# EAGLE board step400_proto_r4 (EAGLE 9.6.2), part 1 of 2
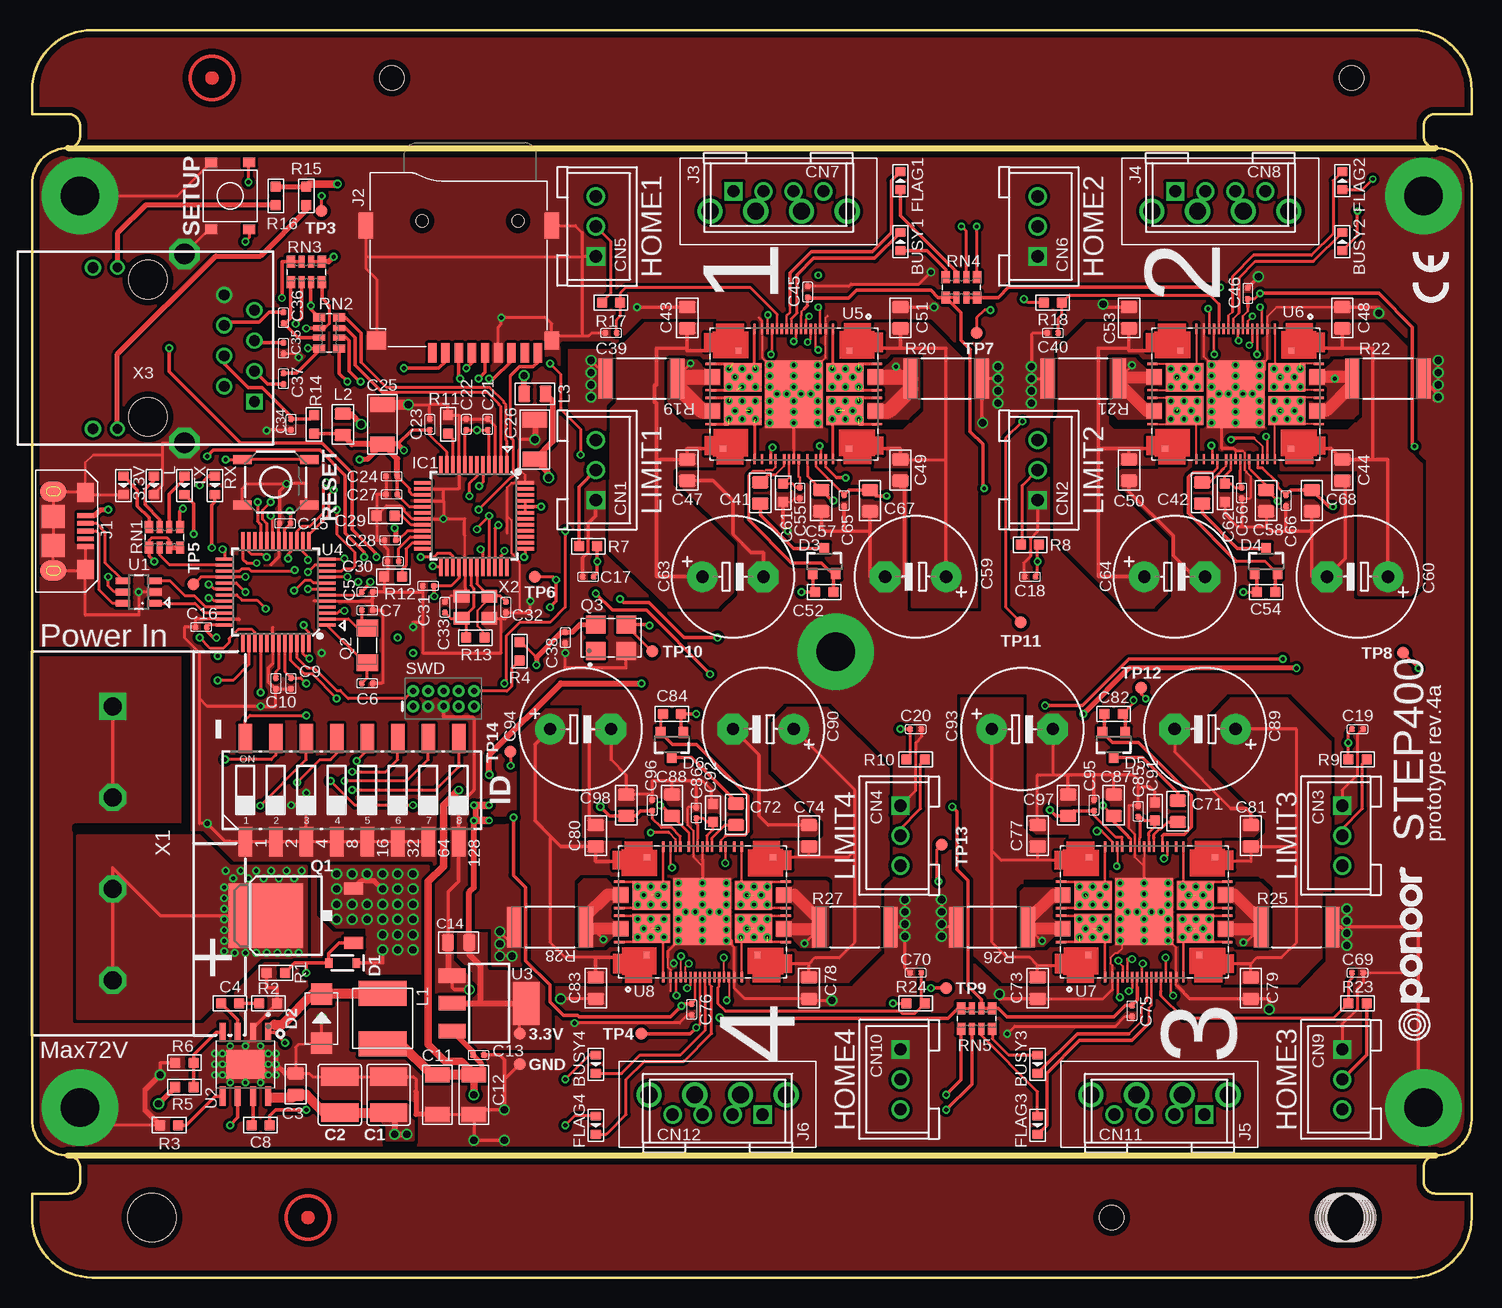
[diagram p3: board, top side]
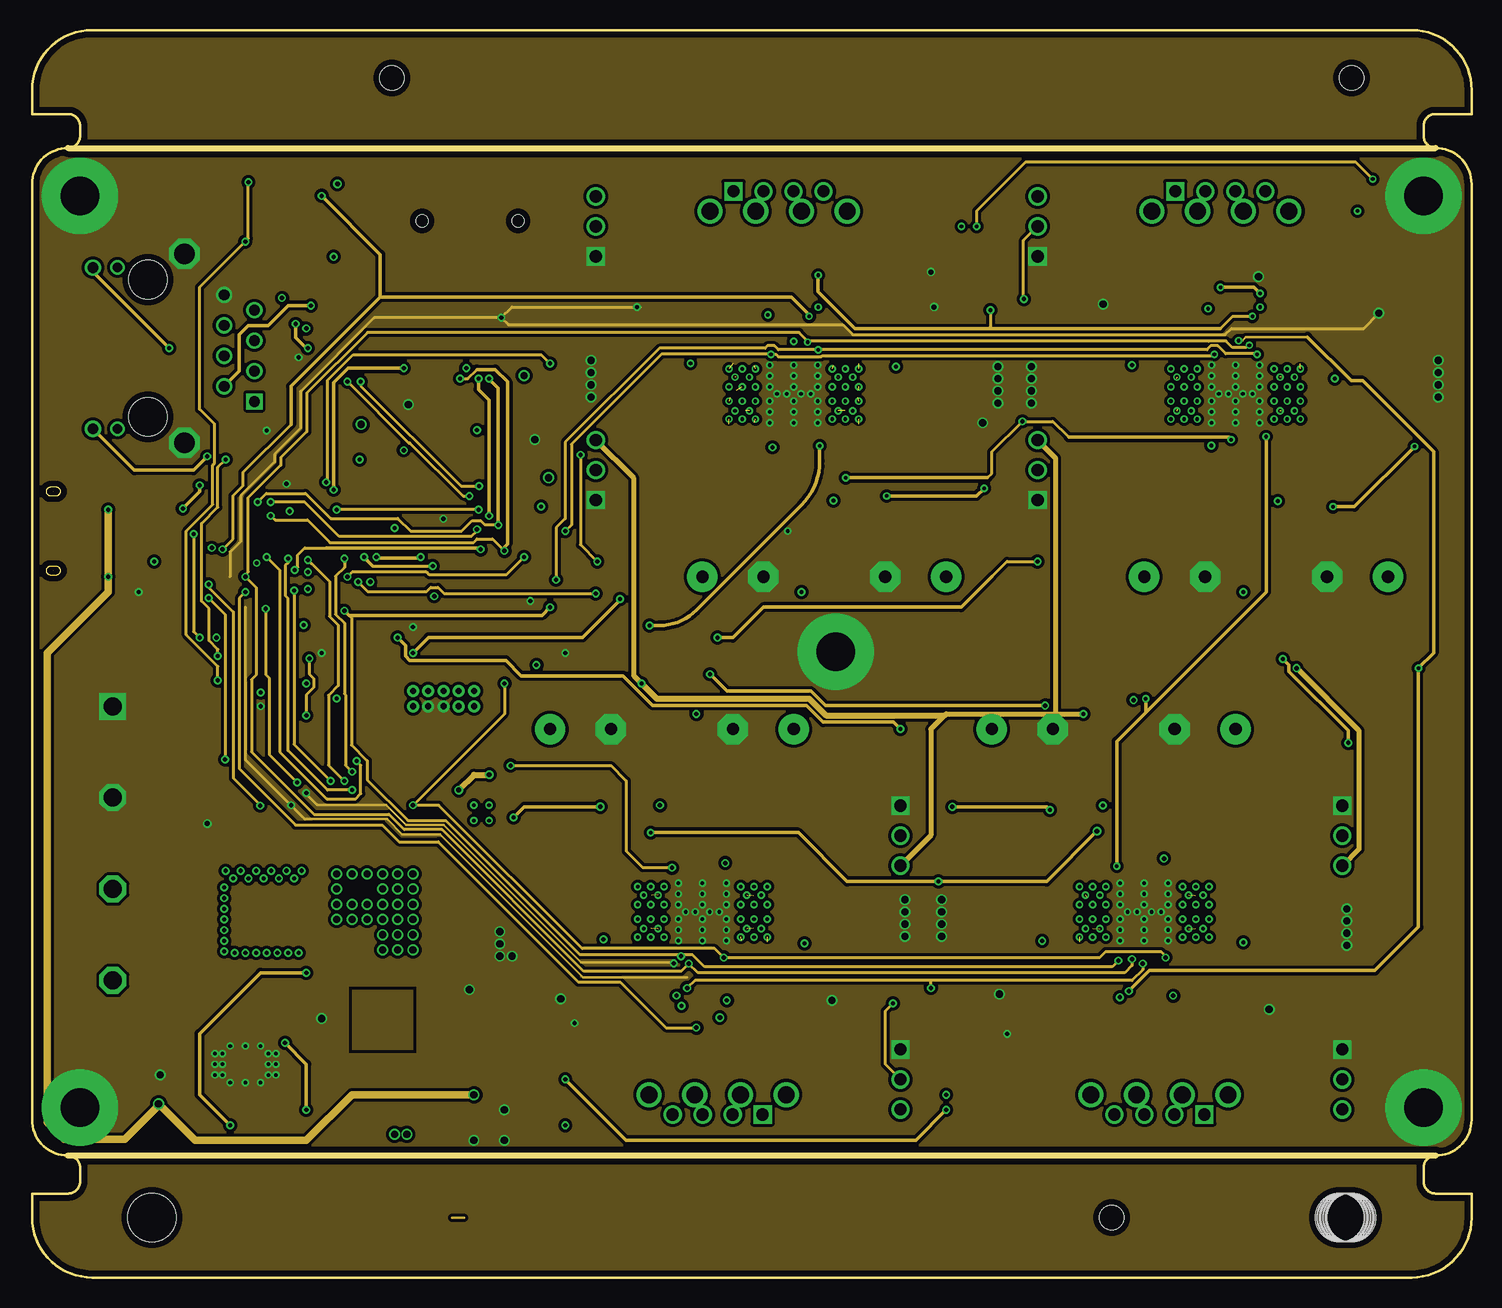
[diagram p4: board, inner layer Route2]
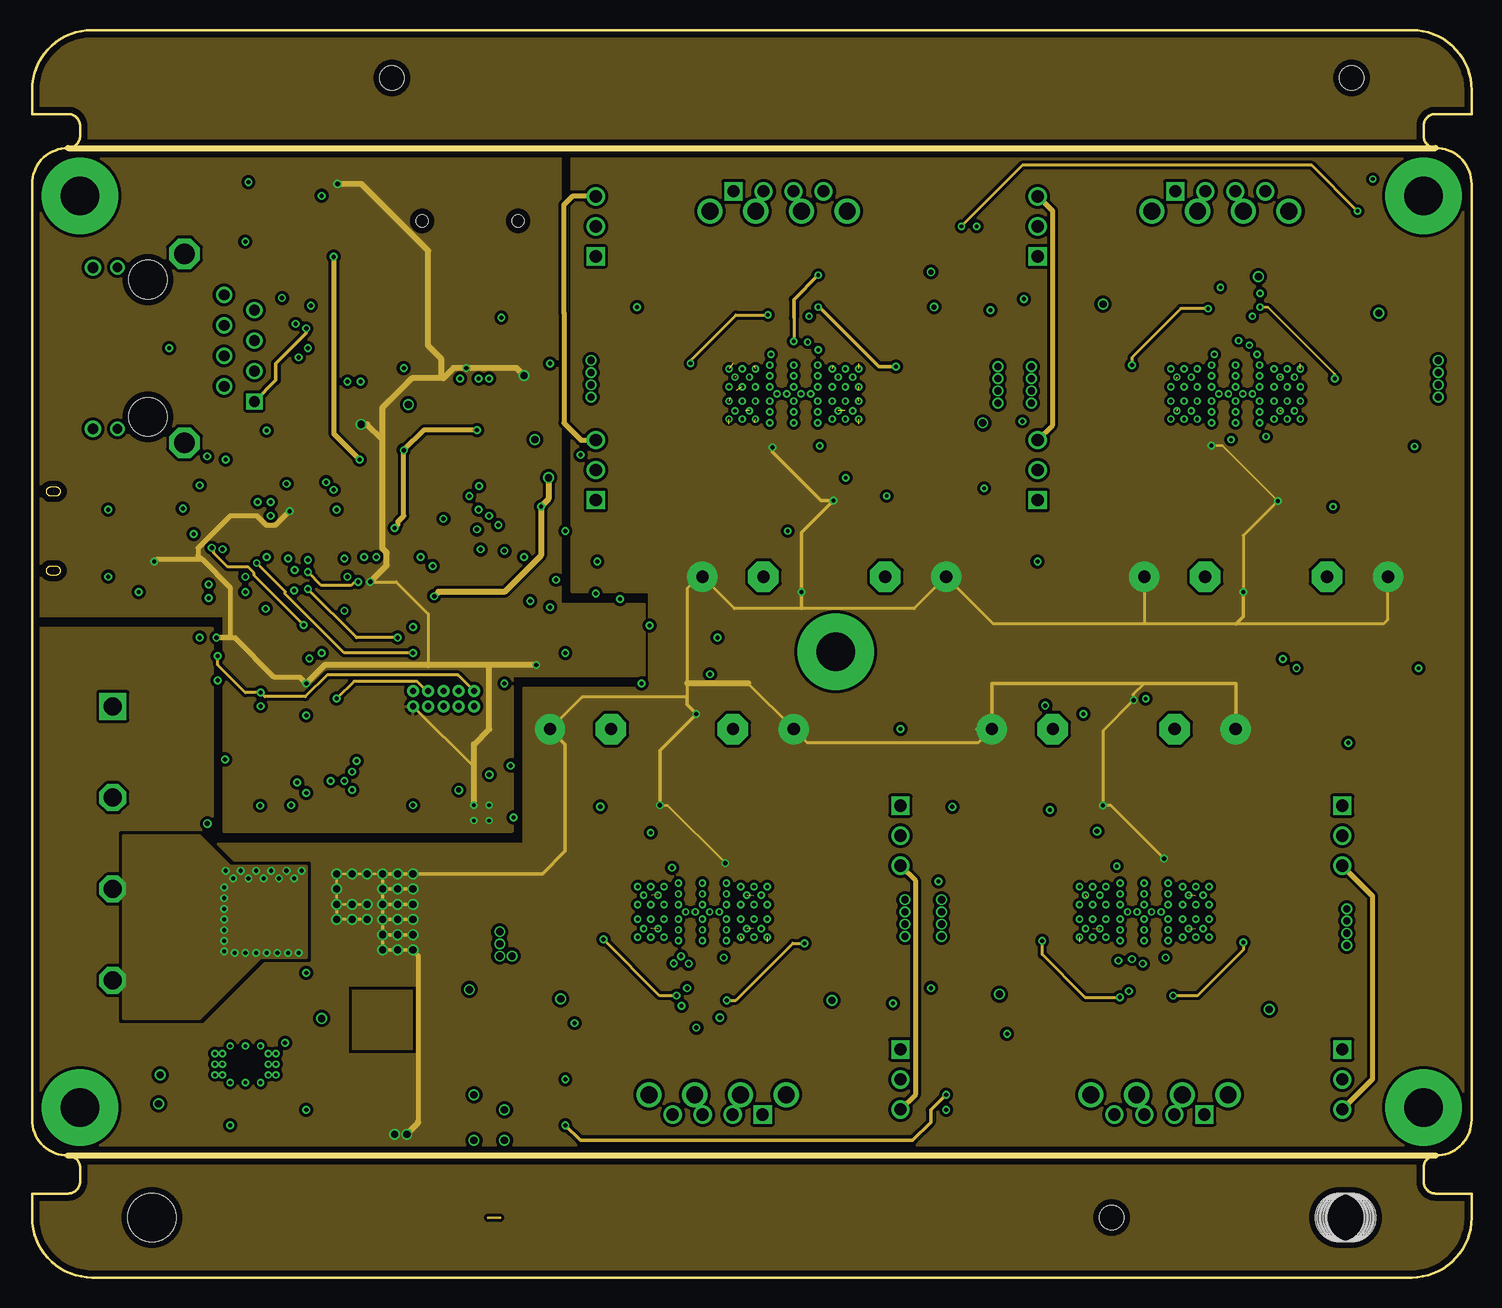
[diagram p5: board, inner layer Route15]
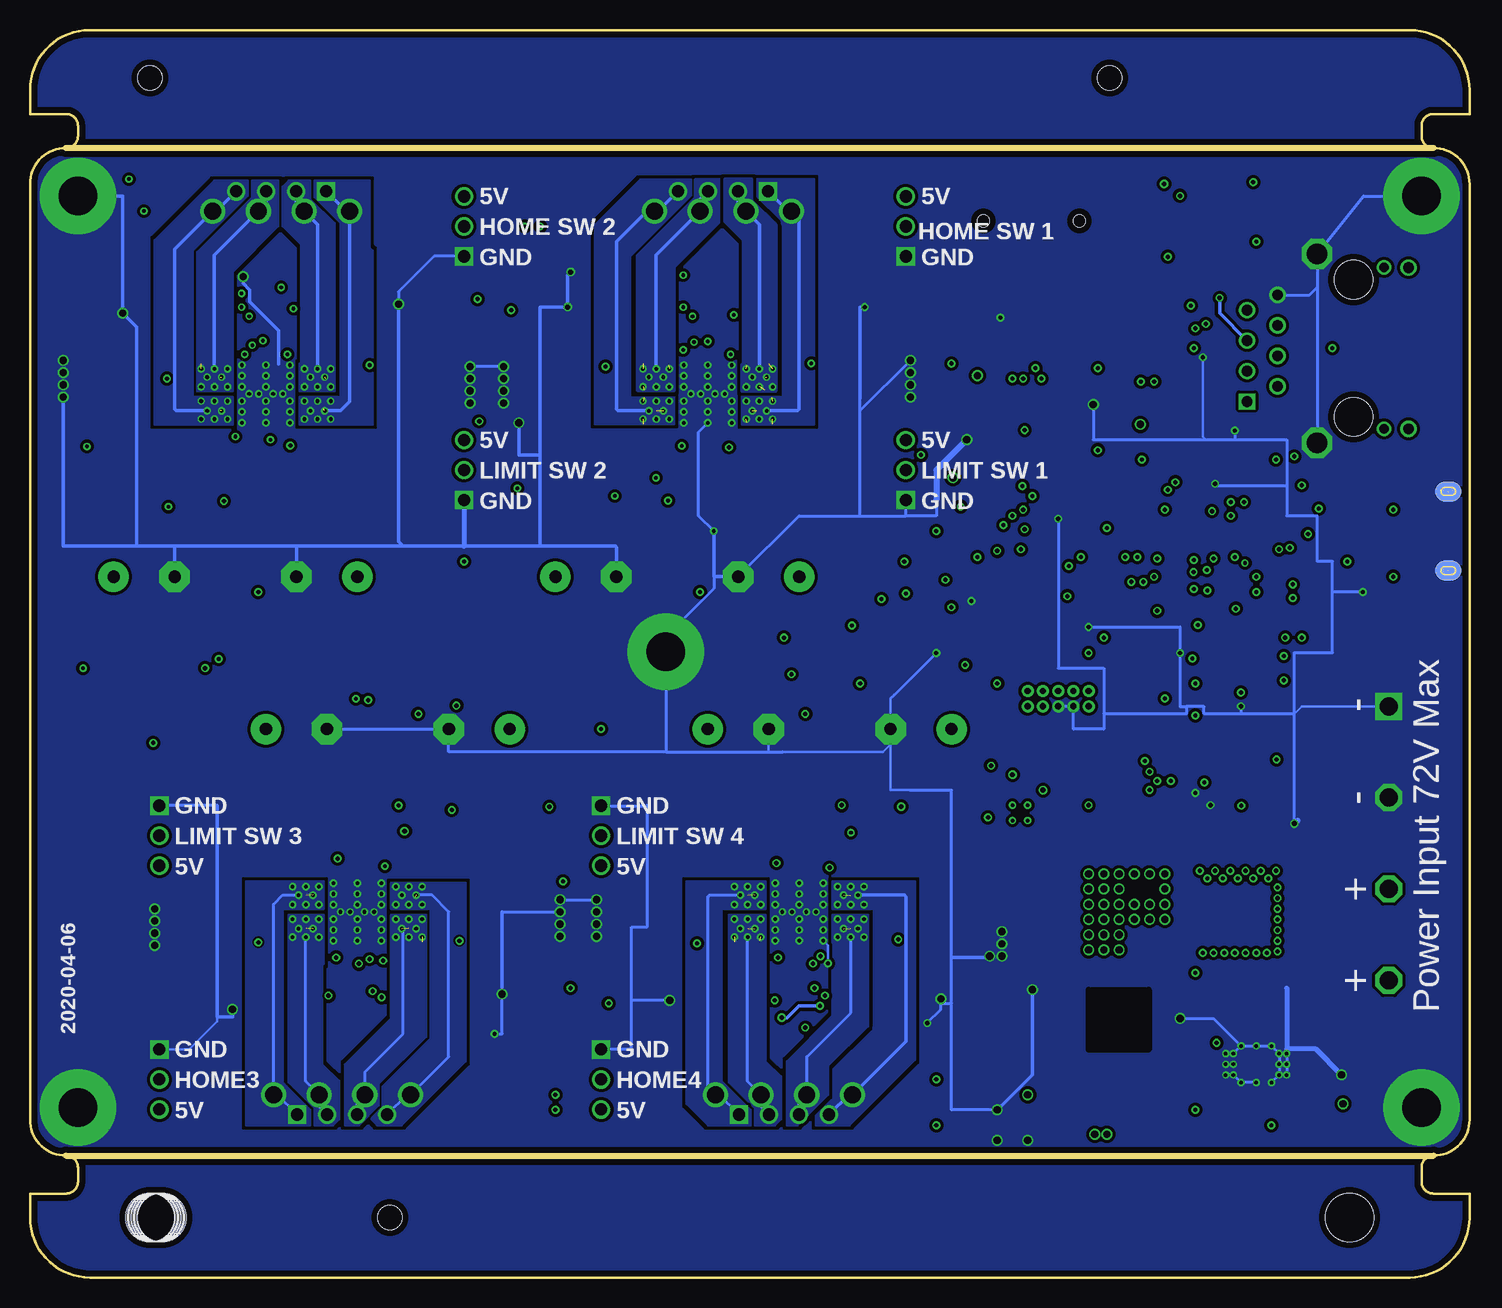
[diagram p6: board, bottom side, seen from below]

Size 120 x 104 mm. Coordinates in mm from the lower left corner, seen from the top.
Outline: 3,94.16 117,94.16
Outline: 117,10.16 3,10.16
Outline: 3,10.16 arc-90 0,13.16 0,91.16 arc-90 3,94.16
Outline: 117,10.16 arc90 120,13.16 120,91.16 arc90 117,94.16
Outline: 117,10.16 arc90 116,9.16 116,8 arc90 117,7 120,7 120,5 arc-90 115,0 5,0 arc-90 0,5 0,7 3,7 arc90 4,8 4,9.16 arc90 3,10.16
Outline: 3,94.16 arc90 4,95.16 4,96 arc90 3,97 0,97 0,99 arc-90 5,104 115,104 arc-90 120,99 120,97 117,97 arc90 116,96 116,95.16 arc90 117,94.16
Copper layers (1+2*15+16): Top 0.035mm / dielectric 1.6mm / Route2 0.035mm / dielectric 1.2mm / Route15 0.035mm / dielectric 0.2mm / Bottom 0.035mm
Design rules "PcbGoGo_4-layer_PCB_eagle_rule *": minimum track width 6mil, minimum drill 12mil, track to track 6mil, track to pad 6mil, pad to pad 6mil, via to via 8mil, smd to smd 0mil, copper to edge 20mil, drill to drill 10mil, minimum pad ring 6mil, minimum via ring 6mil, stop-mask expansion 2mil, vias tented up to drill 100mil, thermal gap 10mil
Holes 2.05 mm at 110,100 90,5 30,100
Holes 4 mm at 10,5 109,5 109.1,5 109.2,5 109.3,5 109.4,5 109.4,5 109.5,5 109.6,5 109.7,5 109.8,5 109.9,5 110,5
tRestrict: area 26.7,19.1 to 31.8,24.1; area 0,52.1 to 13,52.3; area 12.7,37.6 to 13,52.1; area 3.6,37.3 to 13,37.6; area 44.3,72.5 to 44.5,77.7; 2 lines
bRestrict: area 26.7,19 to 31.7,24
vRestrict: area 27.9,19.1 to 33,24.1

## Footprints (pad centres in the part's own frame; a part is rotated, then mirrored left to right if it is on the bottom)
LED-0603 = smd 0.762 x 0.889: + -0.762,0; - 0.762,0
C1210 = smd 1.55 x 3.1: 1 -1.5,0; 2 1.5,0
C0805 = smd 1.397 x 1.016: 1 0,0.889; 2 0,-0.889
C0603 = smd 0.889 x 0.889: 1 0,0.762; 2 0,-0.762
C0402 = smd 0.5 x 0.5: 1 0,0.463; 2 0,-0.463
C1206 = smd 1.27 x 2.032: 1 -1.651,0; 2 1.651,0
E5-10,5 = drill 1.016 pad 2.54: + -2.54,0 | drill 1.016 pad 2.54 octagon: - 2.54,0
B3B-XASK-1 = drill 1.016 square: 1 -2.5,0 | drill 1.016: 2 0,0; 3 2.5,0
B4B-XASK-1 = drill 1.016 square: 1 -3.75,0 | drill 1.016: 2 -1.25,0; 3 1.25,0; 4 3.75,0
SOD-323 = smd 0.63 x 0.83: A 1.15,0; C -1.15,0
DO-214AC = smd 1.8 x 1.77: 1 -2.042,0; 2 2.042,0
SOT23-3 = smd 0.8 x 0.9: 1 -0.95,-1; 2 0.95,-1; 3 0,1.1
TQFP48-LONG = smd 1.5 x 0.28: 1 -4.25,2.75; 2 -4.25,2.25; 3 -4.25,1.75; 4 -4.25,1.25; 5 -4.25,0.75; 6 -4.25,0.25; 7 -4.25,-0.25; 8 -4.25,-0.75; 9 -4.25,-1.25; 10 -4.25,-1.75; 11 -4.25,-2.25; 12 -4.25,-2.75; 25 4.25,-2.75; 26 4.25,-2.25; 27 4.25,-1.75; 28 4.25,-1.25; 29 4.25,-0.75; 30 4.25,-0.25; 31 4.25,0.25; 32 4.25,0.75; 33 4.25,1.25; 34 4.25,1.75; 35 4.25,2.25; 36 4.25,2.75 | smd 0.28 x 1.5: 13 -2.75,-4.25; 14 -2.25,-4.25; 15 -1.75,-4.25; 16 -1.25,-4.25; 17 -0.75,-4.25; 18 -0.25,-4.25; 19 0.25,-4.25; 20 0.75,-4.25; 21 1.25,-4.25; 22 1.75,-4.25; 23 2.25,-4.25; 24 2.75,-4.25; 37 2.75,4.25; 38 2.25,4.25; 39 1.75,4.25; 40 1.25,4.25; 41 0.75,4.25; 42 0.25,4.25; 43 -0.25,4.25; 44 -0.75,4.25; 45 -1.25,4.25; 46 -1.75,4.25; 47 -2.25,4.25; 48 -2.75,4.25
CTS-219-08 = smd 1.13 x 2.44: 1 -8.89,-4.3; 2 -6.35,-4.3; 3 -3.81,-4.3; 4 -1.27,-4.3; 5 1.27,-4.3; 6 3.81,-4.3; 7 6.35,-4.3; 8 8.89,-4.3; 9 8.89,4.3; 10 6.35,4.3; 11 3.81,4.3; 12 1.27,4.3; 13 -1.27,4.3; 14 -3.81,4.3; 15 -6.35,4.3; 16 -8.89,4.3
MICROUSB-FCI-PBAN = smd 0.4 x 1.35: 1 -1.3,1.27; 2 -0.65,1.27; 3 0,1.27; 4 0.65,1.27; 5 1.3,1.27 | smd 1.7 x 2.2: S1 -3.3,-1.4; S2 3.3,-1.4 | smd 1.6 x 1.4: S3 -3.2,1.27; S4 3.2,1.27 | smd 1.9 x 1.9: S5 -1.2,-1.405; S6 1.2,-1.405 | smd 1.7 x 2.2 bottom: S7 -3.3,-1.4; S8 3.3,-1.4
TF-115K = smd 0.7 x 1.6: 1 2.2,0; 2 1.1,0; 3 0,0; 4 -1.1,0; 5 -2.2,0; 6 -3.3,0; 7 -4.4,0; 8 -5.5,0; CD -6.6,0 | smd 1.6 x 1.5: SHIELD1 6.85,-1 | smd 1.2 x 2.2: SHIELD2 7.75,-10.6; SHIELD4 -7.75,-10.6 | smd 1.2 x 1.5: SHIELD3 -7.75,-1 | hole 1: -4.95,-11; 3.05,-11
691321300004 = drill 1.4: 1 -5.715,0; 2 -1.905,0; 3 1.905,0; 4 5.715,0
L5045_L = smd 2.1 x 4: P$1 -2.1,0; P$2 2.1,0
L0805 = smd 1.016 x 1.397: 1 -0.889,0; 2 0.889,0
D-PAK_TO252AA = smd 1 x 1.6: 1 -2.28,-4.8; 3 2.28,-4.8 | smd 5.4 x 6.2: 4 0,2.5
FC-135 = smd 1.4 x 1.8: P$1 -1.45,0; P$2 1.45,0
SG5032 = smd 1.5 x 1.6: 1 -1.1,1.27; 2 -1.1,-1.27; 3 1.1,-1.27; 4 1.1,1.27
R0603 = smd 0.889 x 0.889: 1 0,0.762; 2 0,-0.762
RESC6332X71N = smd 1.194 x 3.353: 1 -2.972,0; 2 2.972,0
TACTILE_SWITCH_SMD_5.2MM = smd 1.524 x 0.762: 1 -2.794,1.905; 2 2.794,1.905; 3 -2.794,-1.905; 4 2.794,-1.905
CAY16_LONG_W = smd 0.7 x 1: 1 -1.3,-0.85; 4 1.3,-0.85; 5 1.3,0.85; 8 -1.3,0.85 | smd 0.5 x 1: 2 -0.4,-0.85; 3 0.4,-0.85; 6 0.4,0.85; 7 -0.4,0.85
STANDOFF-ELECTRICAL = drill 3.2 pad 6.35: P1 0,0
K2-1127SN-A4SW-01 = smd 0.8 x 1: P$1 -2.8,1.6; P$2 2.8,1.6; P$3 -2.8,-1.6; P$4 2.8,-1.6
2X5-PTH-1.27MM = drill 0.508 pad 1: 1 -2.54,-0.635; 2 -2.54,0.635; 3 -1.27,-0.635; 4 -1.27,0.635; 5 0,-0.635; 6 0,0.635; 7 1.27,-0.635; 8 1.27,0.635; 9 2.54,-0.635; 10 2.54,0.635
PAD.03X.04 = smd 1.016 x 1.016: P$1 0,0
SOT23-6L = smd 0.55 x 1.2: 1 -0.95,-1.3; 2 0,-1.3; 3 0.95,-1.3; 4 0.95,1.3; 5 0,1.3; 6 -0.95,1.3
SOIC127P600X100-9N = smd 1.61 x 0.58: 1 -2.655,1.905; 2 -2.655,0.635; 3 -2.655,-0.635; 4 -2.655,-1.905; 5 2.655,-1.905; 6 2.655,-0.635; 7 2.655,0.635; 8 2.655,1.905 | smd 2.4 x 3.2: 9 0,0
SOT223 = smd 1.219 x 2.235: 1 -2.311,-3.099; 2 0,-3.099; 3 2.311,-3.099 | smd 3.6 x 2.2: 4 0,3.099
TQFP-48 = smd 1.5 x 0.28: 1 -4.25,2.75; 2 -4.25,2.25; 3 -4.25,1.75; 4 -4.25,1.25; 5 -4.25,0.75; 6 -4.25,0.25; 7 -4.25,-0.25; 8 -4.25,-0.75; 9 -4.25,-1.25; 10 -4.25,-1.75; 11 -4.25,-2.25; 12 -4.25,-2.75; 25 4.25,-2.75; 26 4.25,-2.25; 27 4.25,-1.75; 28 4.25,-1.25; 29 4.25,-0.75; 30 4.25,-0.25; 31 4.25,0.25; 32 4.25,0.75; 33 4.25,1.25; 34 4.25,1.75; 35 4.25,2.25; 36 4.25,2.75 | smd 0.28 x 1.5: 13 -2.75,-4.25; 14 -2.25,-4.25; 15 -1.75,-4.25; 16 -1.25,-4.25; 17 -0.75,-4.25; 18 -0.25,-4.25; 19 0.25,-4.25; 20 0.75,-4.25; 21 1.25,-4.25; 22 1.75,-4.25; 23 2.25,-4.25; 24 2.75,-4.25; 37 2.75,4.25; 38 2.25,4.25; 39 1.75,4.25; 40 1.25,4.25; 41 0.75,4.25; 42 0.25,4.25; 43 -0.25,4.25; 44 -0.75,4.25; 45 -1.25,4.25; 46 -1.75,4.25; 47 -2.25,4.25; 48 -2.75,4.25
IC_POWERSTEP01_VIA = smd 0.5 x 0.5: 1 -3.6,4.65; 23 -3.6,-4.6; 43 4.55,-5.9; 66 4.55,4.6 | smd 0.86 x 0.19: 7 -5.435,3.27; 8 -5.435,2.65; 9 -5.435,2.2; 10 -5.435,1.8; 11 -5.435,1.4; 12 -5.435,1; 13 -5.435,0.6; 14 -5.435,0.2; 15 -5.435,-0.2; 16 -5.435,-0.6; 17 -5.435,-1; 18 -5.435,-1.4; 19 -5.435,-1.8; 20 -5.435,-2.2; 21 -5.435,-2.65; 22 -5.435,-3.27; 53 5.435,-3.27; 54 5.435,-2.65; 55 5.435,-1.93; 56 5.435,-1.53; 57 5.435,-0.8; 58 5.435,-0.4; 59 5.435,0; 60 5.435,0.4; 61 5.435,1.13; 62 5.435,1.85; 63 5.435,2.25; 64 5.435,2.65; 65 5.435,3.27 | smd 0.19 x 0.86: 33 -2.51,-6.935; 37 -0.32,-6.935; 38 0.32,-6.935; 42 2.51,-6.935; 76 2.51,6.935; 80 0.32,6.935; 81 -0.32,6.935; 85 -2.51,6.935 | smd 1.26 x 1.3: 34 -1.42,-6.79; 39 1.42,-6.79; 77 1.42,6.79; 82 -1.42,6.79 | smd 2.4 x 3.1: EPAD3 -1.38,-4.26; EPAD4 1.38,-4.26; EPAD7 1.38,4.26; EPAD8 -1.38,4.27 | drill 0.3: EPAD3_VIA1 -2.1,-3.2; EPAD3_VIA2 -0.6,-3.2; EPAD3_VIA3 -1.4,-3.7; EPAD3_VIA4 -2.1,-4.3; EPAD3_VIA5 -0.6,-4.3; EPAD3_VIA6 -1.4,-4.9; EPAD3_VIA7 -2.1,-5.4; EPAD3_VIA8 -0.6,-5.4; EPAD4_VIA1 0.6,-3.2; EPAD4_VIA2 2.1,-3.2; EPAD4_VIA3 1.4,-3.7; EPAD4_VIA4 0.6,-4.3; EPAD4_VIA5 2.1,-4.3; EPAD4_VIA6 1.4,-4.9; EPAD4_VIA7 0.6,-5.4; EPAD4_VIA8 2.1,-5.4; EPAD7_VIA1 0.6,5.4; EPAD7_VIA2 2.1,5.4; EPAD7_VIA3 1.4,4.9; EPAD7_VIA4 0.6,4.3; EPAD7_VIA5 2.1,4.3; EPAD7_VIA6 1.4,3.7; EPAD7_VIA7 0.6,3.2; EPAD7_VIA8 2.1,3.2; EPAD8_VIA1 -2.1,5.4; EPAD8_VIA2 -0.6,5.4; EPAD8_VIA3 -1.4,4.9; EPAD8_VIA4 -2.1,4.3; EPAD8_VIA5 -0.6,4.3; EPAD8_VIA6 -1.4,3.7; EPAD8_VIA7 -2.1,3.2; EPAD8_VIA8 -0.6,3.2; EPAD9_VIA1 -2.4,2; EPAD9_VIA2 -1.5,2; EPAD9_VIA3 -0.6,2; EPAD9_VIA4 0.6,2; EPAD9_VIA5 1.5,2; EPAD9_VIA6 2.4,2; EPAD9_VIA7 -2.4,0; EPAD9_VIA8 -1.5,0; EPAD9_VIA9 -0.6,0; EPAD9_VIA10 0.6,0; EPAD9_VIA11 1.5,0; EPAD9_VIA12 2.4,0; EPAD9_VIA13 -2.4,-2; EPAD9_VIA14 -1.5,-2; EPAD9_VIA15 -0.6,-2; EPAD9_VIA16 0.6,-2; EPAD9_VIA17 1.5,-2; EPAD9_VIA18 2.4,-2; EPAD9_VIA19 0,0.6; EPAD9_VIA20 0,1.4; EPAD9_VIA21 0,-0.6; EPAD9_VIA22 0,-1.4 | smd 5.6 x 4.8: EPAD9 0.04,0
WJ25C-B-7.62-4P = drill 1.5 square: P$1 -11.43,0 | drill 1.5 octagon: P$2 -3.81,0; P$3 3.81,0; P$4 11.43,0
CRYSTAL-3.2-2.5 = smd 1.3 x 1.05: 1 -1.15,-0.925; 2 1.15,-0.925; 3 1.15,0.925; 4 -1.15,0.925
HR871181A = drill 0.9 square: 1 -4.44,-8.89 | drill 0.9: 2 -3.175,-6.35; 3 -1.905,-8.89; 4 -0.635,-6.35; 5 0.635,-8.89; 6 1.905,-6.35; 7 3.175,-8.89; 8 4.445,-6.35; 10 -6.725,4.57; 12 6.725,4.57 | drill 0.8: 9 -6.725,2.54; 11 6.725,2.54 | drill 1.7 octagon: SHIELD1 -7.875,-3.05; SHIELD2 7.875,-3.05 | hole 3.2: -5.715,0; 5.715,0

## Placement (x,y rotation side)
3.3V  GREEN-0603  [LED-0603]  7.62,66.04 270 top
BUSY1  GREEN-0603  [LED-0603]  72.39,86.36 90 top
BUSY2  GREEN-0603  [LED-0603]  109.22,86.36 90 top
BUSY3  GREEN-0603  [LED-0603]  83.82,17.78 270 top
BUSY4  GREEN-0603  [LED-0603]  46.99,17.78 270 top
C1  4.7uF/100V  [C1210]  29.72,15.24 90 top
C2  4.7uF/100V  [C1210]  25.65,15.24 90 top
C3  100nF/100V  [C0805]  21.97,16.13 0 top
C4  100nf  [C0603]  16.51,22.86 270 top
C5  100nf  [C0402]  27.94,57.15 90 top
C6  22pF  [C0402]  27.94,49.53 270 top
C7  22pF  [C0402]  27.94,55.63 90 top
C8  100nf  [C0603]  19.05,12.7 90 top
C9  100nf  [C0402]  21.59,49.53 0 top
C10  100nf  [C0402]  20.32,49.53 0 top
C11  47uF  [C1206]  33.78,15.24 90 top
C12  47uF  [C1206]  36.83,15.24 90 top
C13  100nf  [C0402]  37.21,18.54 90 top
C14  10uF/10V  [C0805]  35.56,27.94 90 top
C15  100nf  [C0402]  21.08,62.87 270 top
C16  100nf  [C0402]  14.1,54.23 270 top
C17  100nF  [C0402]  46.35,58.42 90 top
C18  100nF  [C0402]  83.19,58.42 90 top
C19  100nF  [C0402]  110.49,45.72 270 top
C20  100nF  [C0402]  73.66,45.72 270 top
C21  100nf  [C0402]  37.97,71.12 180 top
C22  100nf  [C0402]  36.2,71.12 180 top
C23  100nf  [C0402]  33.15,71.12 180 top
C24  100nf  [C0402]  29.97,66.8 270 top
C25  47uF/6.3V  [C1206]  29.21,71.12 90 top
C26  47uF/6.3V  [C1206]  41.91,69.85 90 top
C27  100nf  [C0402]  29.97,65.28 270 top
C28  100nf  [C0402]  29.84,61.47 270 top
C29  4.7uF/6.3V  [C0603]  29.46,63.5 90 top
C30  10nf  [C0402]  30.1,59.69 90 top
C31  100nf  [C0402]  33.02,57.66 90 top
C32  22pF  [C0402]  39.5,55.88 0 top
C33  22pF  [C0402]  34.42,55.88 180 top
C34  22NF 50V  [C0402]  21.59,71.12 0 top
C35  10nf  [C0402]  20.95,77.47 0 top
C36  6.8nF  [C0402]  20.95,80.01 180 top
C37  6.8nF  [C0402]  20.95,74.93 0 top
C38  100nf  [C0402]  44.45,53.34 180 top
C39  100nF  [C0402]  48.26,78.74 90 top
C40  100nF  [C0402]  85.09,78.74 90 top
C41  47nF  [C0805]  60.71,65.41 0 top
C42  47nF  [C0805]  97.54,65.41 0 top
C43  220nF  [C0805]  54.61,80.01 0 top
C44  220nF  [C0805]  109.22,67.31 180 top
C45  100nf  [C0402]  64.64,82.17 180 top
C46  100nf  [C0402]  101.35,82.04 180 top
C47  220nF  [C0805]  54.61,67.31 180 top
C48  220nF  [C0805]  109.22,80.01 0 top
C49  220nF  [C0805]  72.39,67.31 180 top
C50  220nF  [C0805]  91.44,67.31 180 top
C51  220nF  [C0805]  72.39,80.01 0 top
C52  470nF  [C0603]  66.04,57.15 270 top
C53  220nF  [C0805]  91.44,80.01 0 top
C54  470nF  [C0603]  102.87,57.15 270 top
C55  100nf  [C0402]  64.01,65.41 0 top
C56  100nf  [C0402]  100.84,65.41 0 top
C57  100nF/100V  [C0805]  65.79,64.77 180 top
C58  100nF/100V  [C0805]  102.87,64.77 180 top
C59  100uF  [E5-10,5]  73.66,58.42 180 top
C60  100uF  [E5-10,5]  110.49,58.42 180 top
C61  470nF  [C0603]  62.61,65.41 180 top
C62  470nF  [C0603]  99.44,65.41 180 top
C63  100uF  [E5-10,5]  58.42,58.42 0 top
C64  100uF  [E5-10,5]  95.25,58.42 0 top
C65  220nF  [C0402]  67.69,64.77 180 top
C66  220nF  [C0402]  104.52,64.77 180 top
C67  22uf  [C0805]  69.85,64.77 180 top
C68  22uf  [C0805]  106.68,64.77 180 top
C69  100nF  [C0402]  110.49,25.4 270 top
C70  100nF  [C0402]  73.66,25.4 90 top
C71  47nF  [C0805]  95.5,38.86 180 top
C72  47nF  [C0805]  58.67,38.61 180 top
C73  220nF  [C0805]  83.82,24.13 180 top
C74  220nF  [C0805]  64.77,36.83 0 top
C75  100nf  [C0402]  91.69,22.23 0 top
C76  100nf  [C0402]  54.99,22.35 0 top
C77  220nF  [C0805]  83.82,36.83 0 top
C78  220nF  [C0805]  64.77,24.13 180 top
C79  220nF  [C0805]  101.6,24.13 180 top
C80  220nF  [C0805]  46.99,36.83 0 top
C81  220nF  [C0805]  101.6,36.83 0 top
C82  470nF  [C0603]  90.17,46.99 90 top
C83  220nF  [C0805]  46.99,24.13 180 top
C84  470nF  [C0603]  53.34,46.99 90 top
C85  100nf  [C0402]  92.2,38.86 180 top
C86  100nf  [C0402]  55.37,38.73 180 top
C87  100nF/100V  [C0805]  90.17,39.37 0 top
C88  100nF/100V  [C0805]  53.34,39.37 0 top
C89  100uF  [E5-10,5]  97.79,45.72 180 top
C90  100uF  [E5-10,5]  60.96,45.72 180 top
C91  470nF  [C0603]  93.6,38.86 0 top
C92  470nF  [C0603]  56.77,38.73 0 top
C93  100uF  [E5-10,5]  82.55,45.72 0 top
C94  100uF  [E5-10,5]  45.72,45.72 0 top
C95  220nF  [C0402]  88.52,39.37 0 top
C96  220nF  [C0402]  51.69,39.37 0 top
C97  22uf  [C0805]  86.36,39.37 0 top
C98  22uf  [C0805]  49.53,39.37 0 top
CN1  [B3B-XASK-1]  46.99,67.31 90 top
CN2  [B3B-XASK-1]  83.82,67.31 90 top
CN3  [B3B-XASK-1]  109.22,36.83 270 top
CN4  [B3B-XASK-1]  72.39,36.83 270 top
CN5  [B3B-XASK-1]  46.99,87.63 90 top
CN6  [B3B-XASK-1]  83.82,87.63 90 top
CN7  [B4B-XASK-1]  62.23,90.55 0 top
CN8  [B4B-XASK-1]  99.06,90.55 0 top
CN9  [B3B-XASK-1]  109.22,16.51 270 top
CN10  [B3B-XASK-1]  72.39,16.51 270 top
CN11  [B4B-XASK-1]  93.98,13.59 180 top
CN12  [B4B-XASK-1]  57.15,13.59 180 top
D1  5.1V  [SOD-323]  25.88,26.21 180 top
D2  100V 2A  [DO-214AC]  24.13,21.59 90 top
D3  BAR43  [SOT23-3]  66.04,59.69 0 top
D4  BAR43  [SOT23-3]  102.87,59.69 0 top
D5  BAR43  [SOT23-3]  90.17,44.45 180 top
D6  BAR43  [SOT23-3]  53.34,44.45 180 top
FLAG1  YELLOW-0603  [LED-0603]  72.39,91.44 90 top
FLAG2  YELLOW-0603  [LED-0603]  109.22,91.44 90 top
FLAG3  YELLOW-0603  [LED-0603]  83.82,12.7 270 top
FLAG4  YELLOW-0603  [LED-0603]  46.99,12.7 270 top
IC1  0982_W5500LONG  [TQFP48-LONG]  36.83,63.5 270 top
ID  219-08  [CTS-219-08]  26.67,40.64 0 top
J1  [MICROUSB-FCI-PBAN]  3.17,62.23 270 top
J2  SDCARD_SLOT_TF-115K  [TF-115K]  35.56,77.09 180 top
J3  691321300004  [691321300004]  62.23,88.9 0 top
J4  691321300004  [691321300004]  99.06,88.9 0 top
J5  691321300004  [691321300004]  93.98,15.24 180 top
J6  691321300004  [691321300004]  57.15,15.24 180 top
L  BLUE-0603  [LED-0603]  10.16,66.04 270 top
L1  150uH  [L5045_L]  29.21,21.59 270 top
L2  330R-1500MA  [L0805]  25.91,71.12 270 top
L3  330R-1500MA  [L0805]  41.91,73.66 0 top
Q1  SUD50P08-25L-E3  [D-PAK_TO252AA]  22,30.16 90 top
Q2  32.768kHz  [FC-135]  27.94,52.7 270 top
Q3  16MHz  [SG5032]  48.26,53.34 90 top
R1  100k  [R0603]  20.32,25.4 90 top
R2  4.7k  [R0603]  19.68,22.86 270 top
R3  13k  [R0603]  11.43,12.7 90 top
R4  10K 1/10W  [R0603]  40.64,52.2 180 top
R5  3k  [R0603]  12.7,15.88 270 top
R6  750  [R0603]  12.7,17.91 90 top
R7  100R  [R0603]  46.35,60.96 90 top
R8  100R  [R0603]  83.19,61.09 90 top
R9  100R  [R0603]  110.49,43.18 270 top
R10  100R  [R0603]  73.66,43.18 270 top
R11  12.4K  [R0603]  34.67,71.12 0 top
R12  10K 1/10W  [R0603]  30.1,58.42 90 top
R13  1M 1/10W  [R0603]  36.96,53.34 270 top
R14  10R  [R0603]  23.5,71.12 0 top
R15  330R  [R0603]  22.86,90.17 180 top
R16  330R  [R0603]  20.32,90.17 180 top
R17  100R  [R0603]  48.26,81.28 90 top
R18  100R  [R0603]  85.09,81.28 90 top
R19  0.1  [RESC6332X71N]  50.8,74.93 180 top
R20  0.1  [RESC6332X71N]  76.2,74.93 0 top
R21  0.1  [RESC6332X71N]  87.63,74.93 180 top
R22  0.1  [RESC6332X71N]  113.03,74.93 0 top
R23  100R  [R0603]  110.49,22.86 270 top
R24  100R  [R0603]  73.66,22.86 90 top
R25  0.1  [RESC6332X71N]  105.41,29.21 0 top
R26  0.1  [RESC6332X71N]  80.01,29.21 180 top
R27  0.1  [RESC6332X71N]  68.58,29.21 0 top
R28  0.1  [RESC6332X71N]  43.18,29.21 180 top
RESET  [TACTILE_SWITCH_SMD_5.2MM]  20.32,66.29 0 top
RN1  330  [CAY16_LONG_W]  11.05,61.72 180 top
RN2  33  [CAY16_LONG_W]  24.77,78.74 270 top
RN3  49.9  [CAY16_LONG_W]  22.86,83.82 180 top
RN4  330  [CAY16_LONG_W]  77.47,82.55 0 top
RN5  330  [CAY16_LONG_W]  78.74,21.59 180 top
RX  RED-0603  [LED-0603]  15.24,66.04 270 top
S2  STANDOFF_ELECTRICAL  [STANDOFF-ELECTRICAL]  67,52.16 0 top
S3  STANDOFF_ELECTRICAL  [STANDOFF-ELECTRICAL]  116,90.16 0 top
S4  STANDOFF_ELECTRICAL  [STANDOFF-ELECTRICAL]  116,14.16 0 top
S5  STANDOFF_ELECTRICAL  [STANDOFF-ELECTRICAL]  4,90.16 0 top
S6  STANDOFF_ELECTRICAL  [STANDOFF-ELECTRICAL]  4,14.16 0 top
SETUP  SWITCH-SPST_K2-1127SN-A4SW-01  [K2-1127SN-A4SW-01]  16.51,90.17 270 top
SWD  CORTEX_DEBUGPTH  [2X5-PTH-1.27MM]  34.29,48.26 0 top
TP1  TEST-POINT3X4  [PAD.03X.04]  40.64,20.32 0 top
TP2  TEST-POINT3X4  [PAD.03X.04]  40.64,17.78 0 top
TP3  TEST-POINT3X4  [PAD.03X.04]  24.13,88.9 0 top
TP4  TEST-POINT3X4  [PAD.03X.04]  50.8,20.32 0 top
TP5  TEST-POINT3X4  [PAD.03X.04]  13.46,57.78 0 top
TP6  TEST-POINT3X4  [PAD.03X.04]  41.91,58.42 0 top
TP7  TEST-POINT3X4  [PAD.03X.04]  78.74,78.74 0 top
TP8  TEST-POINT3X4  [PAD.03X.04]  114.3,52.07 0 top
TP9  TEST-POINT3X4  [PAD.03X.04]  76.2,24.13 0 top
TP10  TEST-POINT3X4  [PAD.03X.04]  51.69,52.2 0 top
TP11  TEST-POINT3X4  [PAD.03X.04]  82.42,54.61 0 top
TP12  TEST-POINT3X4  [PAD.03X.04]  92.46,49.15 0 top
TP13  TEST-POINT3X4  [PAD.03X.04]  75.82,36.07 0 top
TP14  TEST-POINT3X4  [PAD.03X.04]  39.88,43.81 0 top
TX  YELLOW-0603  [LED-0603]  12.7,66.04 270 top
U1  USBLC6-2SC6  [SOT23-6L]  8.89,57.15 90 top
U2  BD9G341AEFJ  [SOIC127P600X100-9N]  17.78,17.78 270 top
U3  LD1117S33  [SOT223]  38.1,22.86 270 top
U4  ATSAMD21G-A  [TQFP-48]  20.32,57.15 180 top
U5  POWERSTEP01_VIA  [IC_POWERSTEP01_VIA]  63.5,73.66 270 top
U6  POWERSTEP01_VIA  [IC_POWERSTEP01_VIA]  100.33,73.66 270 top
U7  POWERSTEP01_VIA  [IC_POWERSTEP01_VIA]  92.71,30.48 90 top
U8  POWERSTEP01_VIA  [IC_POWERSTEP01_VIA]  55.88,30.48 90 top
U$1  [PONOOR_TEXT_15MM]  116.84,19.05 90 top
U$2  [FIDUCIAL_MARKER_PBAN]  23,5 0 top
U$3  [FIDUCIAL_MARKER_PBAN]  15,100 0 top
U$4  [CE_3MM]  118.11,81.28 90 top
X1  CONN_04WJ25C-B-7.62  [WJ25C-B-7.62-4P]  6.73,36.2 270 top
X2  25MHz  [CRYSTAL-3.2-2.5]  36.96,55.88 0 top
X3  RJ45_MAGNETICS_LED_HR871181A  [HR871181A]  9.65,77.47 90 top

## Tracks (layer width: path | path; a pad name or v marks a point on that pad's centre or on a via)
1V2O
  Top 0.254: C30.2 30.56,60.79 31.52,61.75 IC1.22
3.3V  (via drill 0.3 pad 0.3, 0.35, 0.4 pad 0.3, 0.6)
  Top 0.254: U4.44 21.07,50.51 C9.1 22.4,49.99 v22.86,49.53 | U4.36 14.73,54.4 C16.1 | U4.6 27.23,56.9 C5.1 | RN1.7 11.45,61.45 11.25,61.65 9.96,61.65 9.75,61.44 RN1.5 | U4.17 21.07,62.39 C15.1 | R4.2 40.77,52.96 42.04,51.69 | TP1.P$1 40.64,21.59 41.91,22.86
  Top 0.305: C16.1 14.56,53.89 15.11,53.34 v15.37,53.34 | v28.19,57.99 28.19,57.87 28.11,57.78 28.07,57.78 27.77,57.48 27.77,57.44 C5.1 | v10.19,59.69 9.75,60.13 RN1.5 | v21.46,63.88 21.54,63.8 C15.1 | J2.4 36.66,76.28 v36.2,75.82
  Top 0.406: RN1.7 RN1.8 | R16.2 R15.2 | Q3.4 45.68,54.44 45.04,53.8 C38.2 44.15,53.8 42.04,51.69 v42.04,51.05
  Top 0.508: v36.83,39.37 36.96,39.24 36.96,38.23 v36.83,38.1 36.83,32.51 36.45,32.13 C14.2 36.45,26.92 37.34,26.04 37.34,22.86 | L3.1 v41.02,75.18 | v27.43,71.12 26.54,72.01 L2.1 | U3.2 37.34,22.86 | 37.34,22.86 U3.4 41.91,22.86
  Top 0.61: v38.1,38.1 v36.83,38.1 | v38.1,39.37 v36.83,39.37 | R15.2 23.09,91.16 v25.46,91.16
  Route15 0.254: SWD.1 36.83,42.55 v36.83,39.37 | v28.19,57.99 30.35,57.99 33.02,55.33 33.02,51.05
  Route15 0.406: v22.86,49.53 22.35,50.04 20.19,50.04 16.89,53.34 v15.37,53.34 16.51,53.34 16.51,57.53 14.16,59.88 | v21.46,63.88 20.27,62.69 19.55,62.69 18.75,63.5 16.51,63.5 13.84,60.83 13.84,60.2 14.16,59.88 | v10.19,59.69 10.38,59.88 14.16,59.88
  Route15 0.508: v42.04,51.05 38.1,51.05 | 38.1,51.05 33.02,51.05 24.38,51.05 v22.86,49.53 | 34.29,74.97 34.13,75.13 34.13,76.56 33.02,77.67 33.02,85.6 27.46,91.16 v25.46,91.16 | 34.29,74.97 35.13,75.82 v36.2,75.82 40.39,75.82 v41.02,75.18 | v36.83,39.37 36.83,44.45 38.1,45.72 38.1,51.05 | 29.21,69.85 29.21,60.78 29.56,60.43 29.56,59.36 v28.19,57.99 | 29.21,69.85 29.21,72.52 31.67,74.97 34.29,74.97 | 29.21,69.85 27.94,71.12 v27.43,71.12
  pour Route15 (isolate 0.254, rank 6): 0,94.16 44,94.16 44,56.16 51,56.16 51,50.16 40,50.16 40,37.16 16,37.16 16,55.16 0,55.16
  pour Top (isolate 0.254, rank 4, no thermals): 35.56,28.7 38.35,28.7 38.23,28.57 38.23,25.78 38.48,26.04 42.93,26.04 43.18,25.78 43.18,19.05 36.83,19.05 36.83,25.4 35.56,26.67
5V  (via drill 0.35, 0.4, 0.6)
  Top 0.254: v6.35,58.42 6.35,57.66 6.86,57.15 U1.5
  Top 0.406: R5.2 v10.54,14.48 | J1.1 5.24,63.53 5.71,64.01 v6.35,64.01 | v105.41,50.8 91.44,50.8 v87.63,46.99 | U3.3 36.75,18.8 C13.1 37.07,18.22 37.47,17.82 37.47,17.27 37.08,16.89 C12.2
  Top 0.508: v38.1,41.91 38.1,43.55 44.08,49.53 v50.8,49.53
  Top 0.61: v36.83,15.24 C12.2 36.83,17.02 35.81,18.03 34.42,18.03 33.02,19.43 33.02,33.02 34.29,34.29 34.29,39.37 v35.56,40.64
  Top 0.813: C12.2 C11.2 33.33,16.89 30.73,19.49 L1.P$2
  Route2 0.406: 85.34,46.99 76.2,46.99 76.07,46.86 74.93,45.72 74.93,36.87 CN4.3 | 85.34,46.99 v87.63,46.99 | v105.41,50.8 110.62,45.59 110.62,35.73 CN3.3 | 85.34,46.99 85.34,68.29 CN2.3 | v50.8,49.53 50.16,50.16 50.16,66.64 CN1.3
  Route2 0.508: v38.1,41.91 36.83,41.91 v35.56,40.64 | v50.8,49.53 52.07,48.26 64.77,48.26 66.17,46.86 76.07,46.86
  Route2 0.61: v6.35,64.01 v6.35,58.42 6.35,57.15 1.27,52.07 1.27,12.95 2.7,11.53 7.72,11.53 10.54,14.35 v10.54,14.48 13.59,11.43 22.86,11.43 26.67,15.24 v36.83,15.24
  Route15 0.406: CN5.3 45.05,90.13 44.32,89.41 44.32,80.44 44.34,80.42 44.34,71.23 45.76,69.81 CN1.3 | CN9.3 111.76,16.55 111.76,31.79 CN3.3 | CN2.3 85.09,71.08 85.09,88.9 83.82,90.17 CN6.3 | CN10.3 73.66,15.28 73.66,33.06 CN4.3
!RESET  (via drill 0.35)
  Top 0.254: U4.40 19.07,52 19.05,51.99 v19.05,48.77 | R4.1 39.98,50.77 39.98,49.28 39.59,48.9 SWD.10 | RESET.2 RESET.1 v16.13,68.2
  Route2 0.254: v16.13,68.2 15.48,67.55 15.48,64.21 14.12,62.86 14.12,56.4 14.76,55.76 14.76,53.09 15.48,52.37 v15.48,51.82
  Route15 0.254: SWD.10 35.51,50.21 24.58,50.21 22.78,48.42 19.4,48.42 v19.05,48.77 v19.04,48.76 17.78,48.76 15.48,51.06 v15.48,51.82
+3V3A  (via drill 0.35)
  Top 0.254: IC1.4 38.08,70.55 C21.1 v37.08,70.66 C22.1 36.08,70.54 IC1.8 | IC1.11 34.58,68.8 33.15,70.23 C23.1 | IC1.21 31.3,62.25 30.52,61.47 C28.1 | IC1.17 31.46,64.25 C27.1 | C24.1 31.47,65.76 31.47,65.46 31.69,65.25 IC1.15
  Top 0.305: RN3.1 RN3.2 | C24.1 C27.1 | 30.48,69.47 31.67,70.66 C23.1 | R14.2 25.78,70.36 L2.2
  Top 0.406: v30.99,68.96 30.48,69.47 C25.1 27.94,68.2 v27.3,68.2 | v25.15,85.09 24.73,84.67 RN3.1 | v30.23,62.48 30.31,62.4 C28.1
  Top 0.508: L2.2 26.67,69.47 C25.1 30.43,68.25 C24.1
  Route15 0.406: v37.08,70.66 32.68,70.66 v30.99,68.96 30.99,63.5 30.48,62.99 30.48,62.74 v30.23,62.48 | v27.3,68.2 25.15,70.36 v25.15,85.09
+3V3D  (via drill 0.35, 0.6)
  Top 0.254: IC1.28 35.58,58.31 34.92,57.66 C31.2 | IC1.45 IC1.44 IC1.43
  Top 0.305: v33.53,56.8 33.53,57.61 C31.2 | IC1.44 41.09,64.26 v42.42,64.26
  Top 0.508: L3.2 43.41,73.05 43.41,69.7 C26.1 43.05,67.06 v43.05,66.67
  Route15 0.508: v43.05,66.67 43.05,64.9 v42.42,64.26 42.42,60.2 39.37,57.15 33.88,57.15 v33.53,56.8
ACT  (via drill 0.35)
  Top 0.254: IC1.27 35.08,60.14 34.87,60.36 33.79,60.36 33.49,60.06 v32.38,60.06
  Top 0.305: v28.7,60.07 28.7,60.33 26.67,62.36 26.67,67.06 24.18,69.55 17.4,69.55 11.43,75.51 v11.43,77.47
  Route2 0.305: v32.38,60.06 32.32,59.99 28.78,59.99 v28.7,60.07 | v11.43,77.47 5.08,83.82 X3.12
D13
  Top 0.254: U4.26 11.47,59.4 10.65,60.22 RN1.6
D+
  Top 0.254: J1.3 5.33,62.23 5.56,62.01 5.56,57.34 6.7,56.2 U1.6
DIPSW1  (via drill 0.35)
  Top 0.254: v23.11,51.6 22.92,51.79 22.78,51.79 22.57,52.01 U4.47 | v22.86,46.86 18.16,46.86 17.78,46.48 ID.16
  Route2 0.254: v23.11,51.6 23.11,50.31 23.49,49.93 23.49,49.19 22.86,48.56 v22.86,46.86
DIPSW2  (via drill 0.35)
  Top 0.254: U4.32 15.17,56.4 14.94,56.64 v14.73,56.64 | ID.15 20.32,43.56 19.94,43.18 v16.08,43.18
  Route2 0.254: v14.73,56.64 16.08,55.29 v16.08,43.18
DIPSW3  (via drill 0.35)
  Top 0.254: U4.30 15.17,57.4 14.79,57.78 v14.73,57.78 | ID.14 22.86,43.18 v19.01,39.33
  Route2 0.254: v14.73,57.78 14.73,57.53 16.76,55.49 16.76,41.62 19.01,39.38 v19.01,39.33
DIPSW4  (via drill 0.35)
  Top 0.254: U4.31 17.07,56.9 17.5,56.47 18.76,56.47 v19.48,55.75 | v22.1,41.27 24,43.18 24.89,43.18 25.4,43.69 ID.13
  Route2 0.254: v22.1,41.27 19.78,43.59 19.78,49.96 19.48,50.26 v19.48,55.75
DIPSW5  (via drill 0.35)
  Top 0.254: v19.56,60.07 19.4,60.07 19.18,60.29 18.28,60.29 18.07,60.5 U4.23 | v27.05,43.05 27.94,43.94 ID.12
  Route2 0.254: v19.56,60.07 20.65,58.98 20.65,43.82 24.56,39.91 26.97,39.91 27.4,40.34 27.4,42.7 v27.05,43.05
DIPSW6  (via drill 0.35)
  Top 0.254: U4.12 25.99,59.9 v26.04,59.94 | ID.11 30.48,43.18 29.46,42.16 v26.67,42.16
  Route2 0.254: v26.04,59.94 26.04,59.2 25.3,58.47 25.3,55.28 26.04,54.55 26.04,48.66 26.13,48.56 26.13,42.7 v26.67,42.16
DIPSW7  (via drill 0.35)
  Top 0.254: U4.14 22.57,60.5 22.99,60.09 v22.99,59.82 | ID.10 33.02,43.18 31.24,41.4 v26.04,41.4
  Route2 0.254: v22.99,59.82 23.27,59.53 23.3,59.53 24.8,58.04 24.8,55.12 25.53,54.39 25.53,49.35 24.71,48.53 24.71,42.71 26.02,41.4 v26.04,41.4
DIPSW8  (via drill 0.35)
  Top 0.254: U4.16 21.57,60.5 21.34,60.27 v21.34,59.94 | v26.67,40.64 33.66,40.64 35.56,42.55 ID.9
  Route2 0.254: v21.34,59.94 21.34,59.58 21.16,59.4 21.16,56.8 21.34,56.62 21.34,43.92 24.62,40.64 v26.67,40.64
G1
  pour Top (isolate 0.254): 0,5 arc90 5,0 115,0 arc90 120,5 120,7 116,7 116,10 4,10 4,7 0,7
G2
  pour Route2 (isolate 0.254): 4,10.16 4,7 0,7 0,5 arc90 5,0 115,0 arc90 120,5 120,7 116,7 116,10.16
G3
  pour Route15 (isolate 0.254): 4,10.16 4,7 0,7 0,5 arc90 5,0 115,0 arc90 120,5 120,7 116,7 116,10.16
G4
  pour Bottom: 4,10 4,7 0,7 0,5 arc90 5,0 115,0 arc90 120,5 120,7 117,7 arc-90 116,8 116,10
G5
  pour Top (isolate 0.254): 5,104 arc90 0,99 0,97 4,97 4,94 116,94 116,97 120,97 120,99 arc90 115,104
G6
  pour Route2 (isolate 0.254): 5,104 arc90 0,99 0,97 4,97 4,94 116,94 116,97 120,97 120,99 arc90 115,104
G7
  pour Route15 (isolate 0.254): 4,94 4,97 0,97 0,99 arc-90 5,104 115,104 arc-90 120,99 120,97 116,97 116,94
G8
  pour Bottom (isolate 0.254): 0,99 arc-90 5,104 115,104 arc-90 120,99 120,97 116,97 116,94 4,94 4,97 0,97
GND  (via drill 0.3, 0.3 pad 0.3, 0.35, 0.4 pad 0.3, 0.6)  (2 unrouted)
  Top 0.152: 65.52,76.06 65.52,75.16 | U5.21 60.85,76.69 62.38,75.16 62.52,75.16 | 102.27,75.16 102.75,75.64 102.75,76.37 102.98,76.6 | 102.98,80.12 103,80.14 | 98.27,76.2 98.27,75.16 | U7.59 92.71,34.97 92.7,34.96 | 90.06,26.02 89.92,26.16 89.92,26.68 90.29,27.05 90.49,27.05 90.87,27.43 90.87,29.41 | 90.06,24.02 90,23.96 | 93.87,29.41 95.11,28.17 95.11,27.77 95.36,27.53 | 58.28,27.77 58.28,27.88 | 53,25.86 53,26.67 53,26.86 | 53.2,23.86 53.23,23.89 | 55.43,39.2 C86.2 | U6.59 100.33,68.96
  Top 0.2: 65.52,76.06 66.15,76.69 U5.8 66.15,79.99 66.29,80.14 | U5.21 60.85,79.74 60.58,80.01 | U5.59 63.5,69.09 | 102.98,76.6 U6.8 102.98,80.12 | 90.06,26.02 U7.8 90.06,24.02 | 95.36,27.53 U7.21 95.36,24.4 95.5,24.26 | 58.28,27.77 58.53,27.53 U8.21 58.53,24.13 58.6,24.06 | 53,25.86 53.23,25.63 U8.8 53.23,23.89 | U8.59 55.88,34.84 | U6.21 97.68,76.79 98.27,76.2 | C35.2 21.93,77.01 v22.23,76.71 | C61.1 63.25,64.64 63.55,64.94 C55.2 | C69.1 115.57,25.4 | 55.88,34.29 55.12,35.05 55.12,36.9 55.13,36.91 55.13,37.23 54.62,37.73 54.62,39.13 54.74,39.24 55.33,39.24 C86.2 | 92.71,34.29 91.95,35.05 91.95,36.96 91.44,37.47 91.44,39.37 92.16,39.37 C85.2 | 100.33,68.96 100.38,68.91 100.93,68.91 101.09,68.75 101.09,67.32 101.22,67.19 101.22,67.15 101.6,66.77 101.6,65.02 101.52,64.94 C56.2 | J1.S3 4.45,67.94 5.08,68.58 10.88,68.58
  Top 0.203: IC1.29 36.07,59.26 36.07,61.85 | 40.64,69.85 40.64,69.05 40.56,68.97 40.56,67.43 41.08,66.91 IC1.48 39.99,66.25 39.58,65.83 39.58,63.5 | C33.2 34.93,56.85 35.86,56.85 | C48.1 103.76,80.9 102.98,80.12 | 39.58,63.5 39.58,62.05 | 39.58,63.5 39.95,63.12 39.95,60.38 40.44,59.89 40.44,59.83 40.64,59.63 40.64,55.42
  Top 0.254: C29.1 29.5,64.3 30.75,64.3 31.03,64.03 31.03,63.91 31.69,63.25 IC1.19 v34.29,63.25 | 28.21,56.4 U4.5 23.51,56.4 | 20.07,51.19 U4.42 20.07,54.23 | 20.57,60.07 U4.18 20.57,62.82 C15.2 | 17.24,54.9 U4.35 13.63,54.9 C16.2 12.7,54.23 12.7,53.34 13.97,52.07 13.97,48.26 | IC1.14 34.29,65.75 | 35.58,71.61 IC1.9 35.58,65.75 34.29,65.75 | IC1.29 36.08,57.08 | J1.S6 J1.S2 4.45,58.93 J1.S4 | J1.S6 | J1.S5 J1.S1 4.34,65.53 J1.S3 4.6,65.28 3.3V.- | J1.S5 | U2.2 18.41,19.94 v17.78,19.3 | 100.33,68.96 100.2,69.09 99.19,69.09 99.19,71.08 99.27,71.16 | C22.2 C21.2 38.29,71.26 38.3,71.26 38.58,70.98 IC1.3 | Q3.2 49.53,50.8 44.45,50.8 v44.45,52.07 C38.1 | ID.3 v22.86,40.39 21.84,39.37 v21.59,39.37 | J1.5 J1.S4 | U1.2 v8.89,57.15 8.89,55.22 4.45,55.22 J1.S4 | 33.27,13.59 C11.1 C12.1 v36.83,11.43 | C9.2 C10.2 20.32,47.62 v19.05,47.62 14.61,47.62 13.97,48.26 | 16.53,36.34 ID.1 ID.2 ID.3 | ID.3 ID.4 ID.5 ID.6 ID.7 | v14.61,37.85 13.97,37.85 13.97,48.26 | 28.45,56.64 28.4,56.64 C7.2 29.21,55.63 29.21,49.53 C6.1 | 29.34,57.15 R12.1 29.64,58.42 C30.1 29.64,60.71 29.38,60.96 C28.2 28.7,61.47 C29.1 | 29.34,57.15 C5.2 | C29.1 28.7,65.28 C27.2 C24.2 | C23.2 33.15,72.77 | 35.6,71.58 35.6,71.88 R11.1 34.67,72.77 33.15,72.77 | v34.29,63.25 | IC1.16 34.29,64.75 | 34.29,64.75 v34.29,63.25 | 34.29,64.75 34.29,65.75 | 36.07,61.85 36.07,63.25 v34.29,63.25 | X2.2 39.12,54.95 | 39.12,54.95 39.5,54.95 C32.2 40.64,55.42 41.53,55.42 v41.53,56.39 | C31.1 32.56,57.15 | 32.56,57.15 32.56,54.61 | 32.56,54.61 32.56,52.07 39.12,52.07 39.12,54.95 | 29.34,57.15 32.56,57.15 | 32.56,54.61 31.75,54.61 v31.75,54.24 | J1.S5 J1.S6 | v31.37,72.77 33.15,72.77 | v81.28,20.32 81.92,20.95 90.3,20.95 91.11,21.76 C75.2
  Top 0.254: 46.61,22.86 C83.1 v44.07,23.24 | R19.2 47.83,75.23 v46.61,76.45 v46.61,75.44 v46.61,74.42 v46.61,73.41 | C80.1 46.48,37.72 46.48,45.72 C94.- 48.26,43.18 49.53,41.91 C98.1 51.69,40.26 | C96.1 51.69,40.26 | 51.69,40.26 51.69,41.4 53.21,41.4 | C45.2 68.09,82.63 68.28,82.83 73.94,82.83 v74.93,83.82 | R3.1 5.46,12.7 S6.P1 | v41.91,69.85 40.64,69.85 | X3.SHIELD1 10.88,69.59 10.88,68.58 10.88,66.05 10.16,65.32 L.- | v80.52,75.95 v80.52,74.93 | v80.52,74.93 v80.52,73.91 v80.52,72.9 | v83.31,74.93 v83.31,75.95 83.31,78.61 83.44,78.74 C40.1 | v83.31,74.93 v83.31,73.91 v83.31,72.9 | v117.22,73.41 v117.22,74.42 v117.22,75.44 v117.22,76.45 | C77.1 83.82,41.91 85.09,41.91 | 85.09,41.91 86.36,41.91 | C93.- 85.09,41.91 | 99.95,39.12 95.25,43.81 C89.- | v109.6,27.69 v109.6,28.7 109.6,29.21 v109.6,29.72 v109.6,30.73 | v72.77,31.5 v72.77,30.48 v72.77,29.46 v72.77,28.45 72.77,25.83 C70.1 | v75.82,31.5 v75.82,30.48 v75.82,29.46 | v75.82,29.46 v75.82,28.45 | v66.67,23.11 64.9,23.11 C78.1 59.42,23.24 58.6,24.06 | C73.1 89.28,23.24 90.06,24.02 | v40.01,26.8 v38.99,26.8 v38.99,27.81 v38.99,28.83 39.88,27.94 39.88,28.88 R28.2 | v21.21,66.17 22.86,66.17 22.86,64.64 RESET.4 | J2.6 38.86,79.25 39.12,79.5 v39.12,80.01 42.8,80.01 43.31,79.5 43.31,78.74 | J2.SHIELD3 43.31,78.74 | 43.31,78.74 43.56,78.49 45.72,78.49 | J2.SHIELD4 45.28,87.69 45.85,87.12 45.85,85.09 | SETUP.P$3 12.1,90.16 S5.P1 | X3.SHIELD2 14.73,87.37 SETUP.P$4 | J2.SHIELD2 27.81,85.09 | 27.81,85.09 27.81,84.13 28.71,83.23 J2.SHIELD1 | 27.81,85.09 45.85,85.09 | C39.1 46.65,78.74 46.4,78.49 45.72,78.49 | 45.72,78.49 45.85,78.61 45.85,85.09 | CN5.1 46.95,85.09 45.85,85.09
  Top 0.254: CN2.1 83.82,62.18 83.22,61.58 83.22,60.11 82.68,59.56 82.68,58.47 C18.1 | C58.1 102.87,62.61 | 102.87,62.61 103.25,62.23 104.52,62.23 | C56.2 100.84,62.61 | 100.84,62.61 102.87,62.61 | C62.1 99.44,63.63 100.46,62.61 100.84,62.61 | C87.1 90.17,41.66 89.92,41.91 | 89.92,41.91 88.52,41.91 | C85.2 92.2,40.64 | 92.2,40.64 92.2,41.53 91.82,41.91 89.92,41.91 | C91.1 93.6,40.51 93.22,40.89 92.46,40.89 92.2,40.64 | U7.EPAD9 92.71,34.29 92.71,34.97 | C19.1 110.49,45.26 110.49,41.91 109.22,40.64 CN3.1 | C69.1 110.95,24.59 110.45,24.09 110.45,22.36 109.22,21.13 CN9.1 | CN4.1 73.66,40.6 73.66,44.58 74.17,45.09 74.17,45.67 C20.1 | C88.1 53.34,41.27 53.21,41.4 | C86.2 55.37,40.89 54.86,41.4 | 54.86,41.4 53.21,41.4 | C92.1 56.64,39.62 56.64,40.64 55.88,41.4 54.86,41.4 | C76.2 54.66,21.89 53.98,21.21 v45.21,21.21 | 55.88,34.84 55.88,34.29 U8.EPAD9_VIA12 | 53,26.67 53,27.2 U8.EPAD9_VIA1 | U8.EPAD9 58.28,28.11 58.28,27.77 | 32,15.51 32,16.51 31.77,16.74 C1.2 C2.2 23.39,16.74 23.11,17.02 C3.1 21.97,19.18 22.17,19.38 D2.1 v24.13,21.59 | v21.21,66.17 21.08,66.04 | RESET.3 17.53,65.79 17.91,66.17 v21.21,66.17 | C34.2 19.6,70.66 v19.56,70.61 | 63.5,69.09 U5.EPAD9_VIA12 | v80.52,74.93 R20.2 | v83.31,74.93 R21.2 | R26.2 76.07,29.21 v75.82,29.46
  Top 0.305: 28.21,56.4 28.45,56.64 28.4,56.69 C5.2 | C10.2 20.03,49.36 19.98,49.36 19.69,49.66 19.68,49.66 19.68,50.8 20.07,51.19 | 20.57,60.07 19.94,59.44 | 17.24,54.9 17.27,54.86 | 35.6,71.58 C22.2 | 36.08,57.08 35.86,56.85 X2.4 | U2.2 18.41,20.83 R2.1 20.45,24.13 19.56,24.13 R1.1 | v62.99,62.23 62.48,62.74 62.61,62.87 C61.1 | TP2.P$1 39.37,16.51 | 39.37,16.51 v39.37,13.97 37.21,13.97 C12.1 | v39.37,11.43 v36.83,11.43 | 54.99,66.04 C47.1 56.77,66.42 58.42,64.77 58.42,61.98 59.94,60.45 60.96,60.45 C63.- | C67.1 69.85,62.23 | C65.1 67.69,62.23 | 67.69,62.23 69.85,62.23 | 69.85,62.23 69.85,58.42 C59.- 72.74,58.42 72.74,65.88 72.39,65.88 C49.1 | C51.1 v75.18,80.9 | v50.42,80.9 C43.1 | C64.- 96.9,58.42 95.12,60.2 95.12,61.85 91.44,65.53 C50.1 | C68.1 106.68,62.23 | C66.1 104.52,62.23 106.68,62.23 | 106.68,62.23 106.68,58.42 C60.- 109.47,59.94 109.47,66.17 C44.1 | C48.1 112.27,80.9 v112.27,80.39 | R22.2 116,74.8 117.22,73.58 v117.22,73.41 | C53.1 89.28,80.9 v89.28,81.15 | R20.2 79.17,71.25 v79.25,71.25 | C95.1 88.52,41.91 86.36,41.91 C97.1 | C73.1 80.64,23.24 v80.64,23.62 | v103.12,22.35 103.12,23.24 C79.1 96.52,23.24 95.5,24.26 | C81.1 101.6,38.73 101.22,39.12 99.95,39.12 | 109.6,29.21 115.57,29.21 115.57,25.4 115.57,13.97 116,13.97 S4.P1 | C46.2 102.23,83.39 v102.23,83.44 | v14.61,37.85 16.11,36.34 16.53,36.34 | X1.P$2 X1.P$1 | v10.67,16.89 10.67,17.91 R6.1 | 109.6,27.86 v109.6,27.69 | v109.6,28.7 109.09,29.21 R25.2 | 72.77,28.63 v72.77,28.45 | v72.77,29.46 72.52,29.21 R27.2 | 75.82,31.32 v75.82,31.5 | C90.- 60.58,43.56 60.58,38.48 61.34,37.72 C74.1 | C15.2 20.62,65.58 v21.21,66.17 | C57.1 65.79,62.48 66.04,62.23 67.69,62.23
  Top 0.305: C17.1 45.89,60.01 46.34,60.45 46.34,62.85 46.99,63.5 CN1.1 | C14.1 34.67,32.13 35.56,33.02 ID.8 35.56,39.37 36.83,40.64 36.83,46.61 36.7,46.74 34.29,46.74 SWD.5 | v36.45,24 35.18,24 35,24.18 U3.1 | C13.2 38.99,18.54 39.37,18.16 39.37,16.51
  Top 0.406: R3.1 9.4,13.97 9.4,15.62 v10.67,16.89 | v20.32,18.67 v20.32,17.78 | v20.32,16.89 v20.32,17.78 | v20.32,17.78 v19.68,17.78 | U2.9 18.8,17.78 v19.68,16.89 | C3.1 21.08,17.02 v20.32,17.78 | C11.1 32,13.59 32,15.51 | 116.97,73.15 v117.22,73.41
  Top 0.508: C26.2 v41.91,69.85 | U3.1 34.67,25.5 C14.1
  Top 0.813: C25.2 v31.37,72.77
  Route2 0.2: 52.83,26.29 53.38,26.29 v53.49,26.18
  Route2 0.203: 23.77,39.4 29.5,39.4 31.18,37.72 34.33,37.72 45.76,26.29 52.83,26.29 | 22.73,38.23 29.59,38.23 30.86,36.96 34.01,36.96 45.94,25.02 54.61,25.02
  Route2 0.254: v39.12,80.01 40.01,80.9 50.67,80.9 | 23.77,39.4 22.86,40.31 v22.86,40.39 | 22.73,38.23 v21.59,39.37 17.78,43.18 17.78,55.88 | v39.12,80.01 39.7,79.42 67.58,79.42 68.41,78.59 99.45,78.59 99.98,79.12 111,79.12 v112.27,80.39 | 16.51,58.42 16.51,60.48 17.4,61.37 17.4,65.18 20.23,68.01 20.23,68.64 22.38,70.8 22.38,73.87 28.52,80.01 v39.12,80.01
  Route2 0.305: 50.67,80.9 v50.42,80.9
  Bottom 0.2: C90.- 58.42,43.81 | 57.23,43.81 48.9,43.81 48.26,44.45 C94.- | C94.- 48.26,48.26 47.94,48.58 | C94.- 48.26,40.64 46.68,40.64 | v22.23,76.71 22.23,70.1 21.97,69.85 | CN9.1 106.72,19.01 104.39,21.34 104.39,21.72 | v53.49,26.18 53.49,27.69 U8.EPAD9_VIA1 | X1.P$1 13.97,47.62 14.61,46.99
  Bottom 0.254: S5.P1 8.84,90.16 X3.SHIELD2 12.7,82.55 | v34.29,63.25 34.29,50.8 30.48,50.8 30.48,46.99 | 30.48,46.99 30.48,45.72 33.02,45.72 SWD.3 SWD.5 | v14.61,37.85 14.61,46.99 | 14.61,46.99 19.05,46.99 | 19.05,46.99 22.13,46.99 22.13,47.59 23.59,47.59 | 23.59,47.59 23.59,46.99 30.48,46.99 | v31.75,54.24 24.13,54.24 v24.13,52.07 24.13,47.59 23.59,47.59 | v19.05,47.62 19.05,46.99 | 14.61,46.99 14.61,52.1 11.43,52.1 11.43,57.15 | 11.43,57.15 11.43,59.69 12.7,59.69 12.7,63.5 15.24,63.5 15.24,66.04 | v8.89,57.15 11.43,57.15 | v31.37,72.77 31.37,69.85 21.97,69.85 19.56,69.85 | 19.56,69.85 15.24,69.85 15.24,66.04 | 12.7,82.55 X3.SHIELD1 | v46.61,76.45 50.8,72.26 | 50.8,63.5 50.8,72.26 | 50.8,72.26 50.8,73.28 | C63.- 55.88,63.5 50.8,63.5 | 67,43.81 58.42,43.81 57.23,43.81 | v39.37,13.97 43.18,13.97 43.18,22.86 | 43.18,22.86 43.18,26.67 43.18,40.64 46.68,40.64 | 67,43.81 S2.P1 67,53.43 62.99,57.44 v62.99,62.23 64.26,63.5 64.26,70.5 U5.EPAD9_VIA12 | v81.28,20.32 80.64,20.32 v80.64,23.62 | v66.67,23.11 69.85,23.11 | 69.85,23.11 69.85,29.21 68.58,29.21 68.58,39.37 68.62,39.33 CN4.1 | v44.07,23.24 44.07,22.86 | 44.07,22.86 43.18,22.86 | 47.94,48.58 v44.45,52.07 | X3.8 13.34,81.92 12.7,82.55 | v80.52,75.95 v83.31,75.95 | 67,43.81 85.09,43.81 C93.- C89.- | 80.64,30.48 v75.82,30.48 | v75.82,31.5 v72.77,31.5 | v21.21,66.17 21.21,66.04 15.24,66.04 | 46.99,63.5 CN1.1 | 50.8,63.5 46.99,63.5 | 44.45,64.81 44.45,63.5 46.99,63.5 | CN6.1 86.32,85.13 89.28,82.17 v89.28,81.15 | CN10.1 72.35,19.05 69.85,19.05 69.85,23.11 | v45.21,21.21 44.07,22.35 44.07,22.86 | v19.56,70.61 19.56,69.85 | v15.24,16.89 v15.24,17.78 v15.24,18.67 v15.88,18.67
  Bottom 0.254: v19.05,19.3 21.34,21.59 v24.13,21.59 | v19.05,19.3 v17.78,19.3 v16.51,19.3 v15.88,18.67 | v15.88,18.67 v15.88,17.78 v15.88,16.89 v16.51,16.26 | v17.78,16.26 v19.05,16.26 v19.68,16.89 v20.32,16.89 | v19.05,19.3 v19.68,18.67 v20.32,18.67 | 104.39,39.37 109.18,39.37 CN3.1
  Bottom 0.305: C63.- 62.99,58.42 v62.99,62.23 | v74.93,83.82 75.18,83.57 v75.18,80.9 77.47,80.9 77.47,68.58 | 50.8,73.28 50.8,80.9 v50.42,80.9 | C59.- 71.12,60.87 71.18,60.96 77.47,60.96 | 77.47,60.96 83.82,60.96 88.9,60.96 | 88.9,60.96 97.79,60.96 | 107.95,60.96 97.79,60.96 | 111.12,60.96 111.12,79.25 v112.27,80.39 112.27,90.16 S3.P1 | v117.22,73.41 117.22,60.96 111.12,60.96 | v79.25,71.25 79.25,68.58 77.47,68.58 | v80.64,23.62 80.64,30.48 | v103.12,22.35 103.12,21.72 104.39,21.72 104.39,39.37 | v102.23,83.44 102.23,82.88 101.68,82.32 101.68,81.36 99.27,78.95 99.27,76.16 | 77.47,68.58 77.47,60.96 | 88.9,60.96 89.28,61.34 v89.28,81.15 | C64.- 97.79,60.96 | C60.- 107.95,60.96 | 111.12,60.96 107.95,60.96 | 43.18,26.67 40.13,26.67 v40.01,26.8 | v36.45,24 36.45,16.89 v39.37,13.97
  Bottom 0.406: 15.24,24.13 15.24,19.05 | 15.24,19.05 v15.24,18.67 | v10.67,16.89 12.83,19.05 15.24,19.05 | CN2.1 83.82,60.96
  Bottom 0.508: v41.91,69.85 44.45,67.31 44.45,64.81 | 14.35,38.1 v14.61,37.85
  pour Bottom (isolate 0.254, rank 6, no thermals): 0,10.16 120,10.16 120,94.16 0,94.16
  pour Top (isolate 0.254, rank 6, no thermals): 0,10.16 0,94.16 120,94.16 120,10.16
  pour Route2 (isolate 0.254, rank 6, no thermals): 0,10.16 120,10.16 120,94.16 0,94.16
  pour Top (isolate 0.254, no thermals): 85.09,77.22 82.42,77.22 82.42,72.26 85.09,72.26
  pour Top (isolate 0.254, no thermals): 78.49,72.26 81.41,72.26 81.41,77.22 78.49,77.22
  pour Top (isolate 0.254, no thermals): 48.26,73.28 48.26,77.22 48.13,77.34 45.09,77.34 44.96,77.22 44.96,73.03 45.09,72.9 47.88,72.9
  pour Top (isolate 0.254, no thermals): 118.11,77.47 115.57,77.47 115.57,72.39 118.11,72.39
  pour Top (isolate 0.254, no thermals): 110.49,31.75 107.95,31.75 107.95,26.67 110.49,26.67
  pour Top (isolate 0.254, no thermals): 73.66,32.51 71.12,32.51 71.12,27.43 73.66,27.43
  pour Top (isolate 0.254, no thermals): 74.93,27.43 77.47,27.43 77.47,32.51 74.93,32.51
  pour Top (isolate 0.254, no thermals): 40.77,26.04 40.77,31.24 38.35,31.24 38.35,26.04
LIMIT1  (via drill 0.35)
  Top 0.254: U4.15 22.07,62.21 22.48,62.61 23.15,62.61 24.26,63.72 24.26,66.04 v24.51,66.29 | v43.18,76.2 44.07,75.31 44.07,72.39 45.72,70.74 v45.72,68.58
  Top 0.305: R7.2 v47.12,59.69 47.12,58.72 C17.2
  Route2 0.254: v24.51,66.29 24.61,66.4 24.61,74.77 26.77,76.93 42.45,76.93 v43.18,76.2 | v45.72,68.58 45.72,61.09 v47.12,59.69
LIMIT2  (via drill 0.3, 0.35)
  Top 0.254: U4.24 17.57,59.87 17.88,59.56 v18.72,59.56 | R8.2 83.82,60.96 v83.82,59.69 83.82,58.59 C18.2
  Top 0.305: v57.15,53.34 54.36,53.34 51.44,56.26 49.32,56.26 v49.02,56.56
  Route2 0.254: 80.01,58.42 81.28,59.69 v83.82,59.69
  Route2 0.305: 80.01,58.42 77.47,55.88 60.96,55.88 58.42,53.34 v57.15,53.34 | v31.75,52.07 33.05,53.37 45.9,53.37 49.02,56.5 v49.02,56.56
  Route15 0.254: v18.72,59.56 21.11,57.17 21.11,56.97 26.02,52.07 v31.75,52.07
LIMIT3  (via drill 0.35)
  Top 0.254: U4.11 23.6,59.4 v23,58.8 | R9.2 v109.73,44.58 109.73,45.42 C19.2
  Top 0.305: v46.99,57.02 48.39,55.63 51.22,55.63 56.52,50.33 v56.52,50.29 | v84.45,47.67 87.55,47.67 91.44,51.56 v104.27,51.56
  Route2 0.254: v46.99,57.02 34.34,57.02 33.83,57.53 33.23,57.53 32.85,57.15 28,57.15 27.46,57.69 27.46,57.71 v27.18,57.99
  Route2 0.305: v56.52,50.29 57.91,48.9 64.92,48.9 66.15,47.67 v84.45,47.67 | v104.27,51.56 104.78,51.05 104.78,50.54 109.73,45.59 v109.73,44.58
  Route15 0.254: v27.18,57.99 26.9,57.99 26.59,57.69 24.11,57.69 v23,58.8
LIMIT4  (via drill 0.35)
  Top 0.254: v22.99,57.4 U4.7 | C20.2 73.2,43.48 R10.2
  Top 0.305: C20.2 v72.39,45.72
  Route2 0.305: v72.39,45.72 71.81,46.3 65.94,46.3 64.54,47.7 51.73,47.7 49.27,50.16 40.77,50.16 39.49,51.44 31.49,51.44 31.12,51.81 31.12,52.7 v30.48,53.34
  Route15 0.254: v30.48,53.34 27.05,53.34 v22.99,57.4
LINKLED  (via drill 0.35)
  Top 0.254: IC1.25 33.46,59.25 v33.4,59.31
  Top 0.305: v27.69,60.07 27.69,60.48 26.11,62.05 26.11,66.85 24,68.96 15.11,68.96 v14.61,68.45
  Route2 0.254: 28.39,59.31 v33.4,59.31
  Route2 0.305: v27.69,60.07 27.95,59.81 27.95,59.76 28.39,59.31 | v14.61,68.45 13.46,67.31 8.52,67.31 X3.10
N$1  (via drill 0.35)
  Top 0.152: 53.23,34.27 v53.34,34.16
  Top 0.2: U8.64 53.23,34.27
  Top 0.254: TP14.P$1 v39.88,42.67
  Route2 0.254: v39.88,42.67 48.26,42.67 49.53,41.4 49.53,35.56 50.93,34.16 v53.34,34.16
N$2
  Top 0.254: U4.1 27.71,51.26 Q2.P$2 27.94,50 27.8,49.85 C6.2
N$3
  Top 0.305: C4.1 R2.2
N$4
  Top 0.254: U4.2 26.38,54.9 27.12,54.16 Q2.P$1 27.48,54.62 C7.1
N$5  (via drill 0.35)
  Top 0.305: v12.57,64.11 12.32,63.85 12.32,62.6 RN1.1 | v13.97,66.04 14.73,66.8 RX.+
  Route2 0.305: v12.57,64.11 13.97,65.5 v13.97,66.04
N$6
  Top 0.305: TX.+ 12.7,66.55 11.45,65.3 RN1.2
N$7
  Top 0.305: R5.1 R6.2 13.46,18.54 15.36,20.43 U2.4
N$8  (via drill 0.35)
  Top 0.305: U2.6 17.14,13.34 v16.51,12.7 | Q1.1 25.59,27.88 24.73,27.01 D1.A 22.86,26.21 | R1.2 21.89,26.21 22.86,26.21 | v22.86,25.4 22.86,26.21
  Route2 0.305: v16.51,12.7 13.97,15.24 13.97,20.32 19.05,25.4 v22.86,25.4
N$9
  Top 0.305: U2.5 15.25,15.12 12.83,12.7 R3.2
N$10
  Top 0.305: RN1.3 10.65,63.21 9.41,64.44 9.41,65.73 10.16,66.48 L.+
N$11
  Top 0.305: RN1.4 9.75,63.33 8.76,64.32 8.76,65.66 3.3V.+
N$12
  Top 0.305: U2.3 17.14,21.46 C4.2
N$13
  Top 0.203: X2.3 37.72,56.42 37.72,56.21 37.13,55.62 37.13,54.29 37.72,53.7 R13.1
  Top 0.254: C32.1 39.03,56.8 X2.3 37.08,57.83 IC1.31
N$14
  Top 0.305: R7.1 45.59,65.91 CN1.2
N$15
  Top 0.305: U2.7 18.41,12.83 C8.1
N$16
  Top 0.254: R8.1 82.55,61.21 82.55,66.04 CN2.2
N$17  (via drill 0.35)
  Top 0.254: 24.18,23.69 24.18,23.75 D2.2 24.07,23.74 23.49,23.74
  Top 0.305: C8.2 19.81,13.46 20.32,13.97 v22.86,13.97 | 20.19,21.08 19.68,20.57 U2.1 20.2,20.43 v21.08,19.56
  Top 0.813: 23.49,23.74 20.83,21.08 20.19,21.08 | 24.18,23.69 L1.P$1
  Route2 0.305: v22.86,13.97 22.86,17.78 v21.08,19.56
N$18
  Top 0.305: RN4.8 76.17,84.03 74.61,85.6 BUSY1.+
N$19
  Top 0.305: X3.4 16,76.2 18.03,74.17 19.18,74.17 21.59,71.76 C34.1 23.2,71.58 R14.1
N$20
  Top 0.254: R17.1 48.26,82.04 48.26,86.36 CN5.2
N$21  (via drill 0.35)
  Top 0.305: RN3.3 RN3.4 20.83,84.67 v20.83,81.66 | X3.5 18.71,77.93 C35.1
  Bottom 0.305: X3.5 20.83,80.39 v20.83,81.66
N$22
  Top 0.406: X3.9 7.11,76.96 15.32,85.17 19.04,85.17 22.86,88.99 R15.1
N$23
  Top 0.406: R16.1 9.47,89.41 7.11,87.05 X3.11
N$24
  Top 0.254: IC1.23 31.68,61.25 31.17,60.73 31.17,59.37 30.86,59.06 R12.2
N$25
  Top 0.2: U5.18 62.1,80.27
  Top 0.254: 62.1,80.27 62.1,80.31 59.86,82.55 49.53,82.55 49.02,82.04 R17.2 49.02,80.14 48.72,79.84 C39.2
N$26
  Top 0.2: U6.18 98.93,79.76
  Top 0.254: 98.93,79.76 98.93,81.15 98.17,81.92 86.49,81.92 R18.2 85.85,80.26 85.55,79.97 C40.2
N$27  (via drill 0.35)
  Top 0.254: R18.1 82.97,81.28 v82.68,81.58
  Route2 0.254: v82.68,81.58 82.65,81.58 82.65,86.46 CN6.2
N$28
  Top 0.2: 94.11,23.88 U7.18
  Top 0.254: C69.2 110.03,24.94 109.73,24.64 R23.2 108.46,21.59 96.01,21.59 94.11,23.5 94.11,23.88
N$29
  Top 0.305: R23.1 111.25,18.54 CN9.2
N$30
  Top 0.305: FLAG1.+ 72.39,88.52 77.07,83.84 RN4.7
N$31
  Top 0.2: U8.18 57.28,24.26 57.15,24.13
  Top 0.254: C70.2 74.12,23.16 R24.2 73.58,22.02 72.52,22.02 72.31,22.23 57.78,22.23 57.15,22.86 57.15,24.13
N$32
  Top 0.305: D3.3 63.47,60.79 60.71,63.55 C41.2
N$33
  Top 0.2: U5.57 62.7,67.65 61.98,66.93
  Top 0.254: C41.1 61.34,66.93 61.98,66.93
N$34  (via drill 0.35)
  Top 0.254: v71.75,22.86 R24.1
  Route2 0.254: CN10.2 71.12,17.78 71.12,22.23 v71.75,22.86
N$35
  Top 0.254: R9.1 110.9,42.82 110.9,39.09 109.22,37.41 CN3.2
N$36  (via drill 0.3)
  Top 0.254: BUSY2.+ 110.49,86.87 v110.49,88.9 | RN4.6 77.87,87.23 v77.47,87.63
  Route15 0.254: v110.49,88.9 106.68,92.71 82.55,92.71 v77.47,87.63
N$37  (via drill 0.3)
  Top 0.254: FLAG2.+ 110.87,90.68 v111.76,91.57 | v78.74,87.63 78.74,83.43 RN4.5
  Route2 0.254: v111.76,91.57 110.36,92.96 82.8,92.96 78.74,88.9 v78.74,87.63
N$38
  Top 0.254: IC1.20 31.61,62.75 30.86,63.5 C29.2
N$39
  Top 0.2: U5.16 62.9,80.17
  Top 0.203: 62.9,80.17 63.16,80.43 63.16,81.03
  Top 0.305: FLAG1.- 71.63,91.44 71.63,87.1 70.05,85.52 64.97,85.52 63.16,83.72 63.16,81.03
N$40
  Top 0.254: IC1.10 35.08,69.95 R11.2
N$41
  Top 0.2: U5.15 63.3,79.94
  Top 0.254: 63.3,79.94 63.77,80.41 63.77,82.55
  Top 0.305: BUSY1.- 70.23,84.96 65.15,84.96 63.77,83.58 63.77,82.55
N$42  (via drill 0.3, 0.35)
  Top 0.2: U5.9 65.7,80.73 v65.53,80.9
  Top 0.305: R20.1 73.03,74.93 v72.01,75.95
  Top 1.016: 73.08,75.08 R20.1
  Top 1.27: U5.82 73.08,75.08 | U5.77 71.43,72.24 73.23,74.04 R20.1
  Route15 0.305: v72.01,75.95 70.61,75.95 65.66,80.9 v65.53,80.9
  pour Top (isolate 0.254, no thermals): 69.72,71.63 73.03,71.63 73.91,72.52 73.91,76.58 71.88,76.58 70.87,75.56 69.72,75.56
N$43  (via drill 0.3)
  Top 0.152: 61.3,80.2 v61.34,80.24 | U5.20
  Top 0.2: U5.20 61.3,80.2
  Top 0.254: v54.88,76.2 53.77,75.09 R19.1
  Top 1.016: 53.92,75.08 R19.1 53.77,74.3
  Top 1.27: 53.92,75.08 U5.34 | 53.77,74.3 55.83,72.24 U5.39
  Route15 0.254: v54.88,76.2 54.88,76.45 58.67,80.24 v61.34,80.24
  pour Top (isolate 0.254, no thermals): 57.28,71.63 54.48,71.63 53.09,73.03 53.09,76.33 53.21,76.45 55.37,76.45 56.26,75.56 57.28,75.56
N$44
  Top 0.254: R10.1 74.07,42.82 74.07,39.09 72.39,37.41 CN4.2
N$46  (4 unrouted)
  Top 0.152: U5.EPAD4 59.45,72.28
  Top 0.254: U5.42 58.11,71.15 | U5.38 58.18,73.34 | 60.23,71.29 U5.53
  Bottom 0.305: CN7.1 56.83,88.9 J3.1 55.88,88.27 55.88,72.39 56.01,72.26 U5.EPAD4_VIA6
  pour Bottom (isolate 0.254, rank 2, no thermals): 60.71,73.41 60.71,71.12 54.61,71.12 54.61,91.57 59.44,91.57 59.44,89.92 57.28,87.76 57.28,73.41
N$47  (4 unrouted)
  Top 0.152: U5.EPAD3 59.22,75.06 58.67,75.06
  Top 0.254: U5.37 58.74,73.98 | 59.69,74.93 59.58,75.04 U5.EPAD3 | U5.33 58.45,76.17 | 60.23,76.03 U5.22
  Bottom 0.305: CN7.2 60.98,89.56 J3.2 59.2,87.78 U5.EPAD3_VIA4
  pour Bottom (isolate 0.254, no thermals): 62.1,91.57 62.1,88.01 60.58,86.49 60.58,76.2 60.71,76.07 60.71,73.91 57.78,73.91 57.78,87.76 59.82,89.79 59.82,91.57
N$48  (via drill 0.3, 0.35)
  Top 0.2: U5.14 63.7,78.25 v63.5,78.05 | U6.12 101.33,79.74 v101.73,80.14
  Top 0.254: TP7.P$1 78.74,80.01 79.38,80.64 v79.88,80.64
  Route2 0.254: 99.06,79.12 100.08,80.14 v101.73,80.14 | 80.01,79.12 79.88,79.25 v79.88,80.64
  Route2 0.305: v65.53,83.57 65.53,82.17 68.58,79.12 80.01,79.12 99.06,79.12
  Route15 0.254: 63.5,80.01 v63.5,78.05
  Route15 0.305: v65.53,83.57 63.5,81.53 63.5,80.01
N$49
  Top 0.254: U1.4 6.07,59.62 6.07,62.16 5.35,62.88 J1.2
N$51  (4 unrouted)
  Top 0.152: U5.EPAD8 67.75,75.06 67.18,75.06
  Top 0.254: 68.83,73.98 U5.81 | 68.9,76.17 U5.85 | 66.77,76.04 U5.7
  Bottom 0.305: CN7.3 64.14,89.9 J3.3 67.8,85.23 U5.EPAD8_VIA4
  pour Bottom (isolate 0.254, rank 2, no thermals): 66.29,73.91 69.34,73.91 69.34,85.22 64.52,90.04 64.52,91.57 62.48,91.57 62.48,88.01 66.29,84.2
N$52  (3 unrouted)
  Top 0.254: U5.65 66.77,71.98 67.18,72.39 67.29,72.28 U5.EPAD7 | 68.89,71.15 U5.76 | 68.82,73.34 U5.80
  Bottom 0.305: CN7.4 67.63,88.9 J3.4 68.58,88.9 71.12,86.36 71.12,72.39 70.99,72.26 U5.EPAD7_VIA3
  pour Bottom (isolate 0.254, rank 2, no thermals): 66.29,73.41 66.29,71.12 72.9,71.12 72.9,87.76 69.09,91.57 64.9,91.57 64.9,90.17 69.98,85.09 69.98,73.41
N$53
  Top 0.305: D4.3 100.46,60.79 97.54,63.71 C42.2
N$54
  Top 0.2: U6.57 99.53,67.65 99.31,67.44
  Top 0.254: 99.31,67.44 99.18,67.3 99.18,67.27 98.2,66.29 C42.1
N$56
  Top 0.254: RN5.8 80.04,19.91 81.41,18.54 BUSY3.+
N$57
  Top 0.254: FLAG3.+ 83.82,15.49 79.14,20.17 RN5.7
N$58
  Top 0.2: U6.16 99.73,80.17 100.08,80.52
  Top 0.254: FLAG2.- 108.46,91.44 108.46,87.03 106.65,85.22 101.82,85.22 100.08,83.47 100.08,80.52
N$59
  Top 0.2: U6.15 100.13,79.94 100.58,80.39
  Top 0.254: 100.58,80.39 100.58,83.31 101.98,84.71 106.81,84.71 BUSY2.-
N$61  (via drill 0.3, 0.35)
  Top 0.2: U6.9 102.53,80.73 v102.36,80.9
  Top 0.254: v108.58,74.93 R22.1
  Top 1.016: U6.82 109.91,75.08 R22.1 110.06,74.42 107.88,72.24 U6.77
  Route15 0.203: v102.36,80.9 103,80.9 108.58,75.31
  Route15 0.254: v108.58,74.93 108.58,75.31
  pour Top (isolate 0.254, no thermals): 106.55,75.56 107.7,75.56 108.58,76.45 110.49,76.45 110.49,72.01 110.11,71.63 106.55,71.63
N$62  (via drill 0.3, 0.35)
  Top 0.152: 98.13,80.86 v98.04,80.77
  Top 0.2: U6.20 98.13,80.86
  Top 0.254: v91.69,76.07 91.69,76.02 R21.1
  Top 1.016: U6.34 90.75,75.08 R21.1 90.6,74.55 92.91,72.24 U6.39